# Altium project F2837x_180controlCARD_R1_3_SCH_PADS.PrjPcb (part 1 of 2)
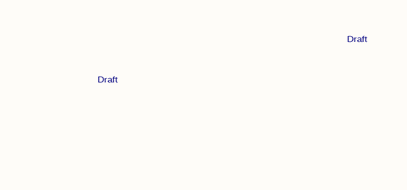
[diagram p0: TITLE.SchDoc, top right]
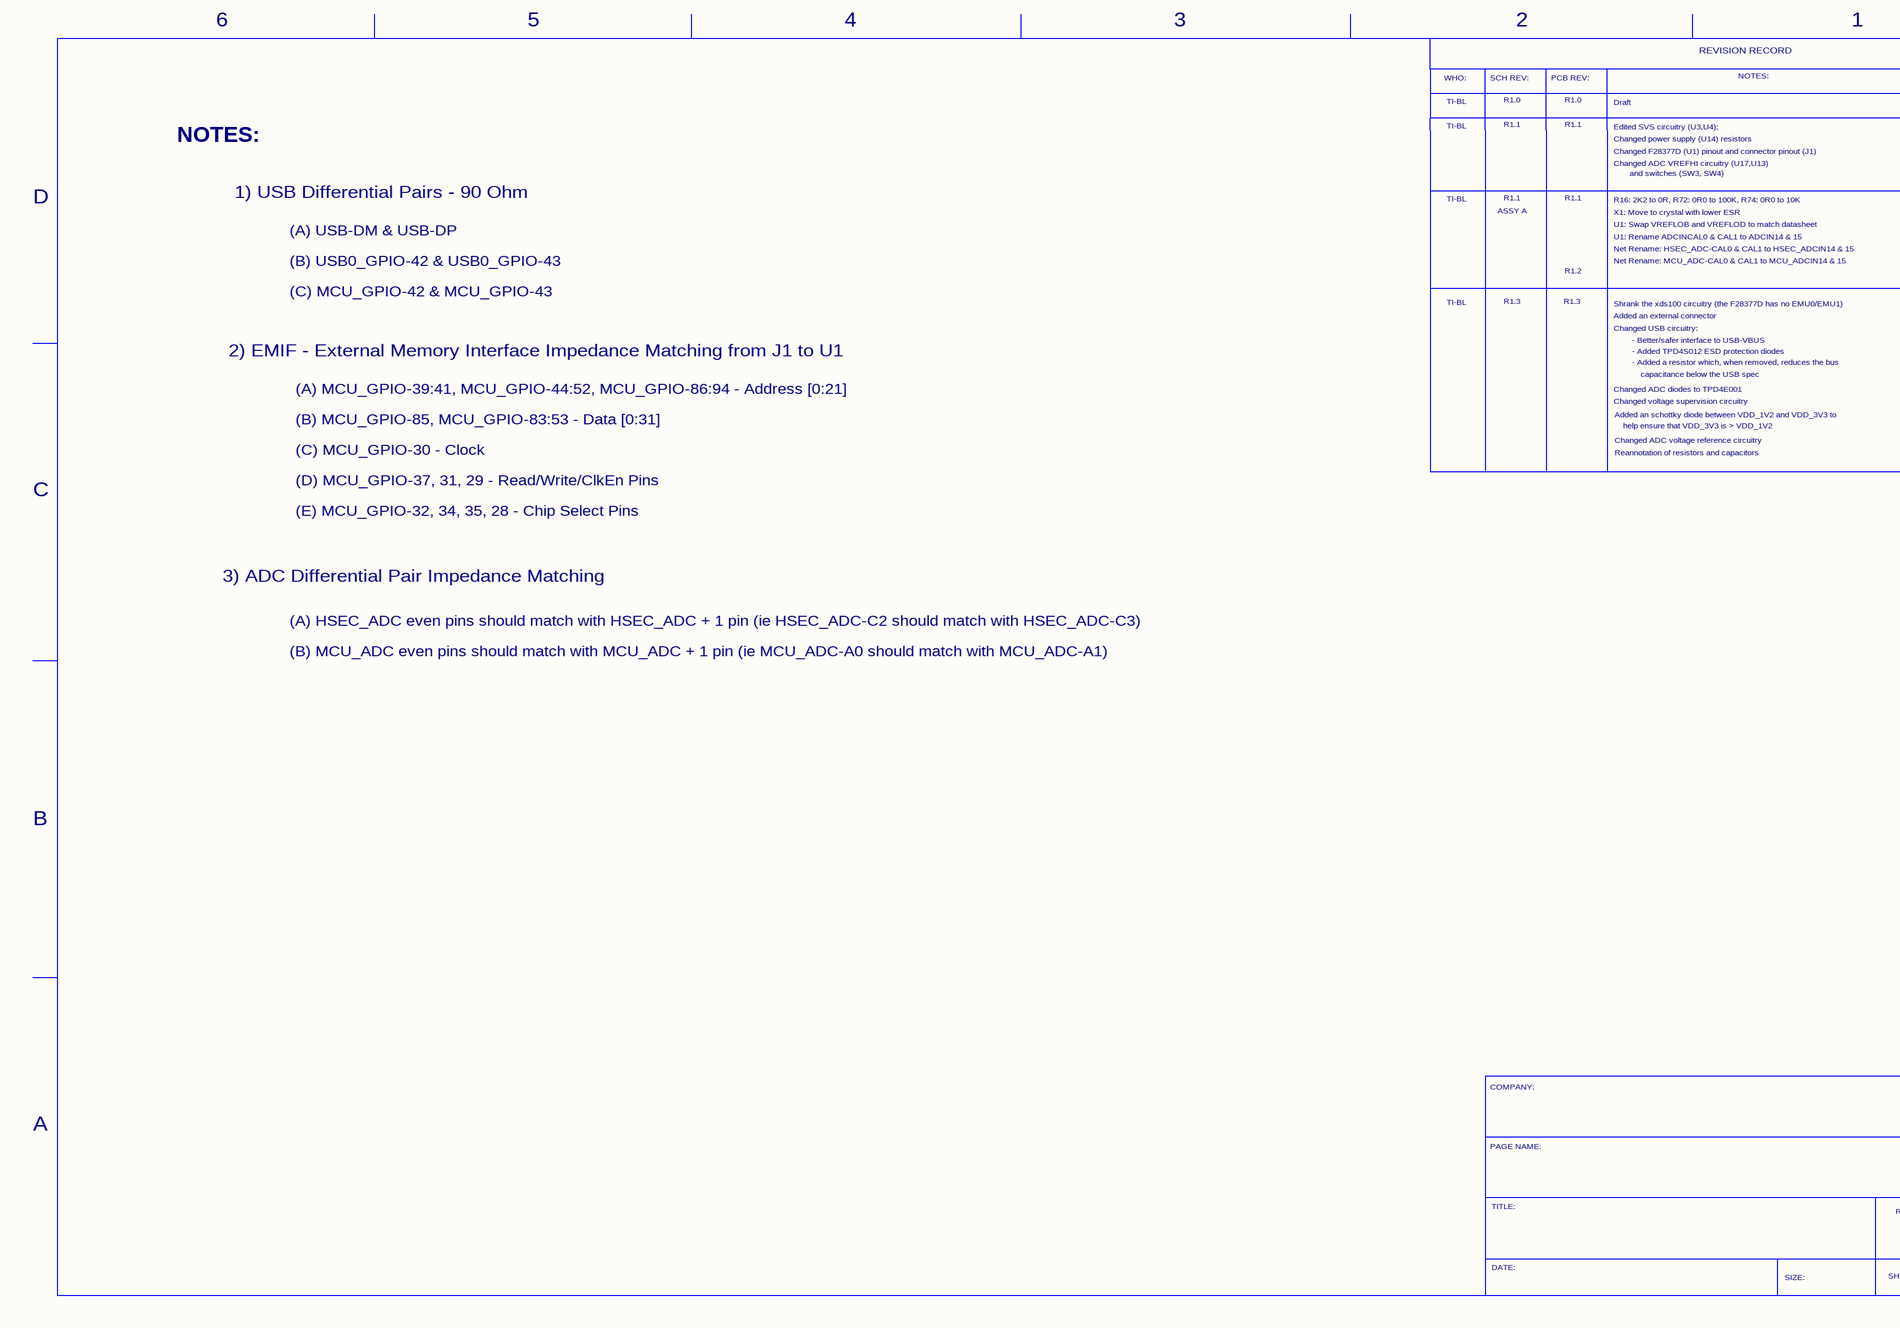
[diagram p1: TITLE.SchDoc, bottom left]
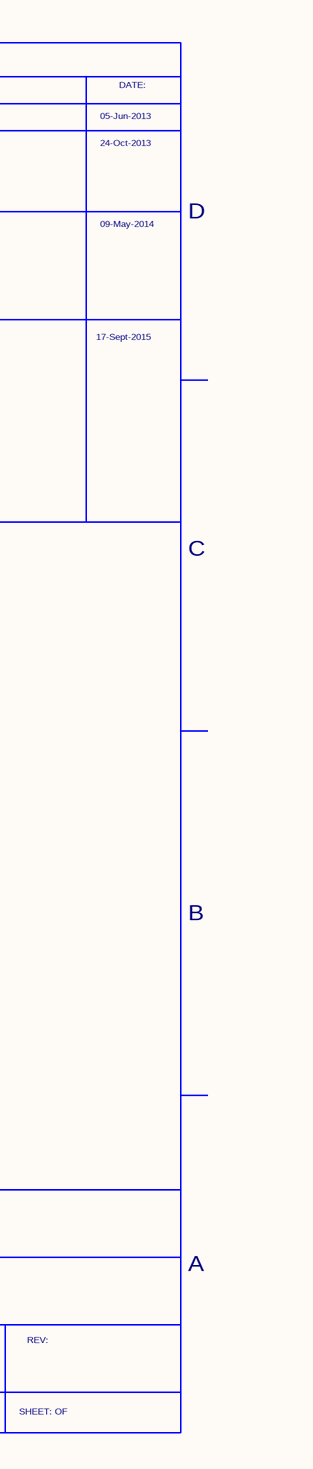
[diagram p2: TITLE.SchDoc, bottom right]
8 sheets, 292 parts. Net scope: flat (ports and power ports of the same name join across sheets).
Board file: {TEX137}_F2837x_controlCARD_R1.3_PCB_PADS.PcbDoc
Sheets:
  TITLE.SchDoc
  GPIO,CONNECTOR.SchDoc
  ADC.SchDoc
  POWER.SchDoc
  USB.SchDoc
  SUPPORT.SchDoc
  XDS100V2_EMULATOR.SchDoc
  EMULATOR_INTERFACE.SchDoc

## Sheet TITLE.SchDoc: F2837x controlCARD
size 431 x 279 mm; Organization: Texas Instruments; Revision: 1.3

### Notes on the sheet
- Draft
- 6
- 5
- 4
- 3
- 2
- REVISION RECORD
- 1
- WHO:
- TI-BL
- SCH REV:
- R1.1
- R1.0
- PCB REV:
- Edited SVS circuitry (U3,U4);
- NOTES:
- 24-Oct-2013
- 05-Jun-2013
- DATE:
- Changed power supply (U14) resistors
- Changed F28377D (U1) pinout and connector pinout (J1)
- Changed ADC VREFHI circuitry (U17,U13)
- and switches (SW3, SW4)
- D
- 1) USB Differential Pairs - 90 Ohm
- (A) USB-DM & USB-DP
- ASSY A
- R16: 2K2 to 0R, R72: 0R0 to 100K, R74: 0R0 to 10K
- Net Rename: HSEC_ADC-CAL0 & CAL1 to HSEC_ADCIN14 & 15
- U1: Swap VREFLOB and VREFLOD to match datasheet
- U1: Rename ADCINCAL0 & CAL1 to ADCIN14 & 15
- X1: Move to crystal with lower ESR
- 09-May-2014
- (B) USB0_GPIO-42 & USB0_GPIO-43
- (C) MCU_GPIO-42 & MCU_GPIO-43
- R1.3
- R1.2
- Net Rename: MCU_ADC-CAL0 & CAL1 to MCU_ADCIN14 & 15
- Shrank the xds100 circuitry (the F28377D has no EMU0/EMU1)
- Added an external connector
- 17-Sept-2015
- 2) EMIF - External Memory Interface Impedance Matching from J1 to U1
- Changed USB circuitry:
- - Better/safer interface to USB-VBUS
- - Added TPD4S012 ESD protection diodes
- - Added a resistor which, when removed, reduces the bus
- capacitance below the USB spec
- (A) MCU_GPIO-39:41, MCU_GPIO-44:52, MCU_GPIO-86:94 - Address [0:21]
- (B) MCU_GPIO-85, MCU_GPIO-83:53 - Data [0:31]
- Changed voltage supervision circuitry
- Changed ADC diodes to TPD4E001
- Added an schottky diode between VDD_1V2 and VDD_3V3 to
- Changed ADC voltage reference circuitry
- help ensure that VDD_3V3 is > VDD_1V2
- C
- (C) MCU_GPIO-30 - Clock
- (D) MCU_GPIO-37, 31, 29 - Read/Write/ClkEn Pins
- Reannotation of resistors and capacitors
- (E) MCU_GPIO-32, 34, 35, 28 - Chip Select Pins
- 3) ADC Differential Pair Impedance Matching
- (A) HSEC_ADC even pins should match with HSEC_ADC + 1 pin (ie HSEC_ADC-C2 should match with HSEC_ADC-C3)
- (B) MCU_ADC even pins should match with MCU_ADC + 1 pin (ie MCU_ADC-A0 should match with MCU_ADC-A1)
- B
- COMPANY:
- A
- PAGE NAME:
- TITLE:
- REV:
- SIZE:
- SHEET: OF

## Sheet GPIO,CONNECTOR.SchDoc: F2837x controlCARD
size 431 x 279 mm; Organization: Texas Instruments; Revision: 1.3
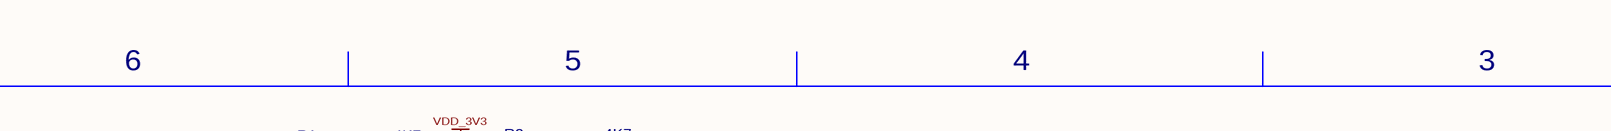
[diagram p3: GPIO,CONNECTOR.SchDoc, top left]
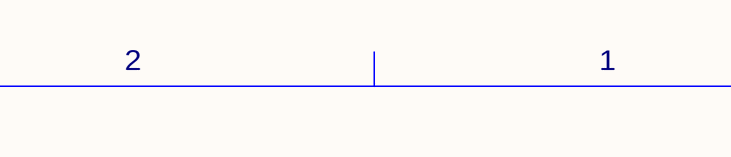
[diagram p4: GPIO,CONNECTOR.SchDoc, top right]
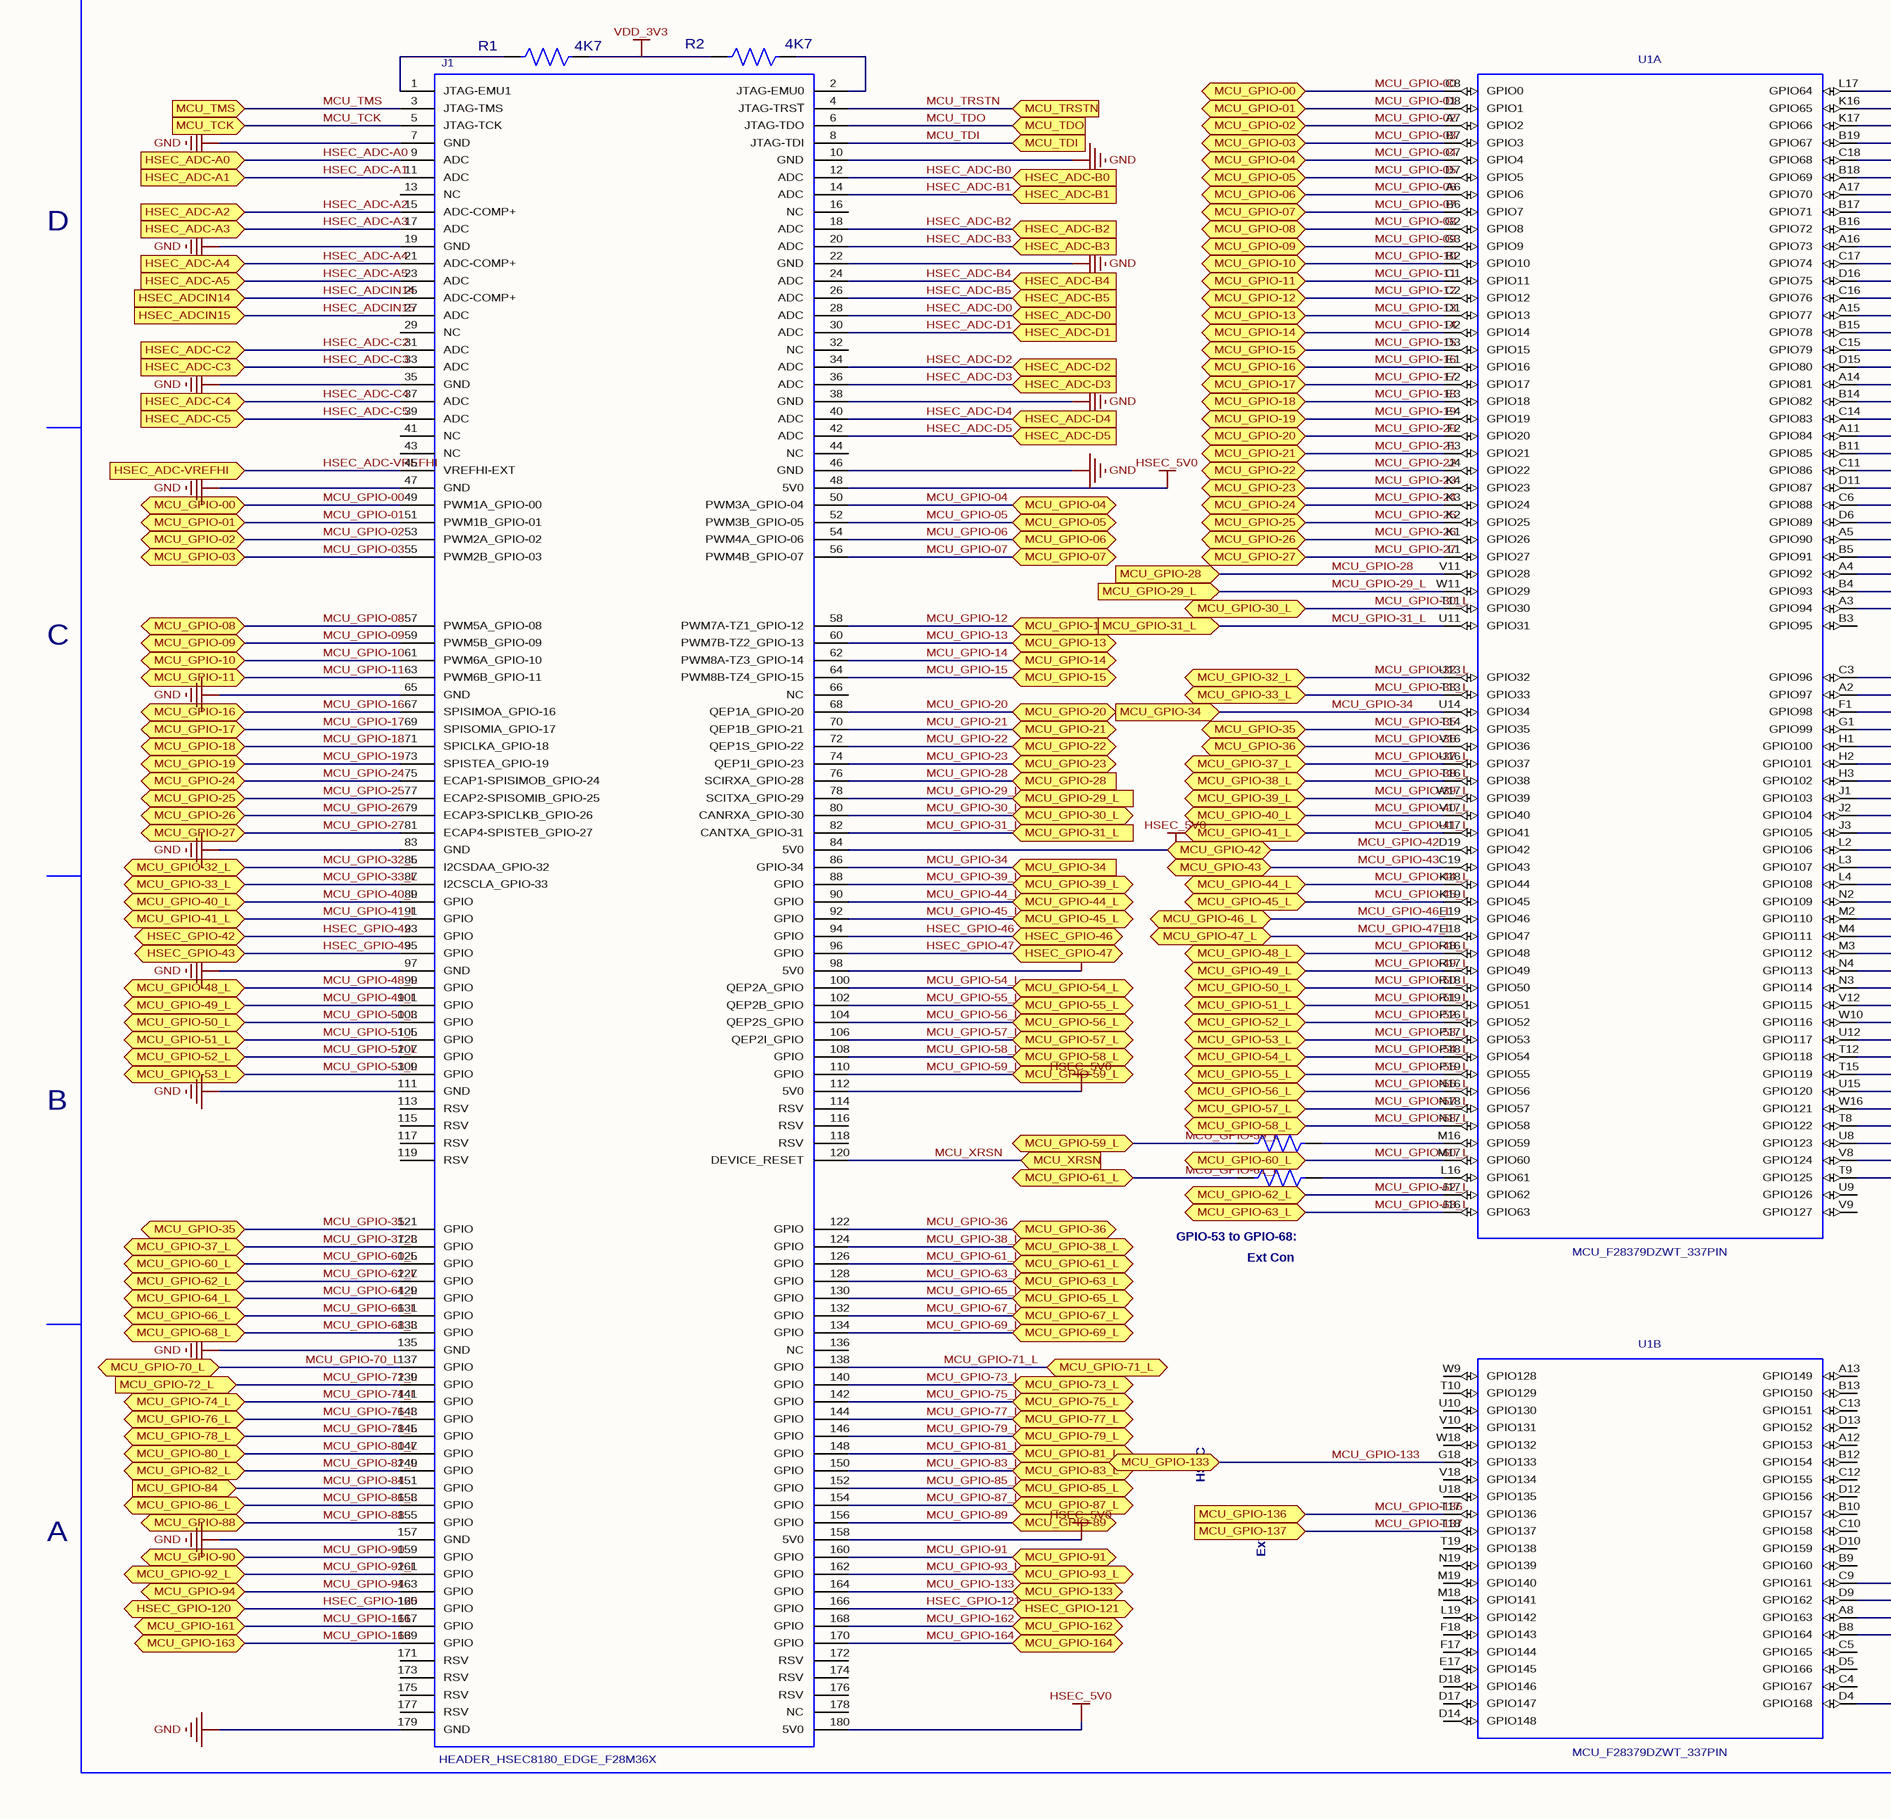
[diagram p5: GPIO,CONNECTOR.SchDoc, bottom left]
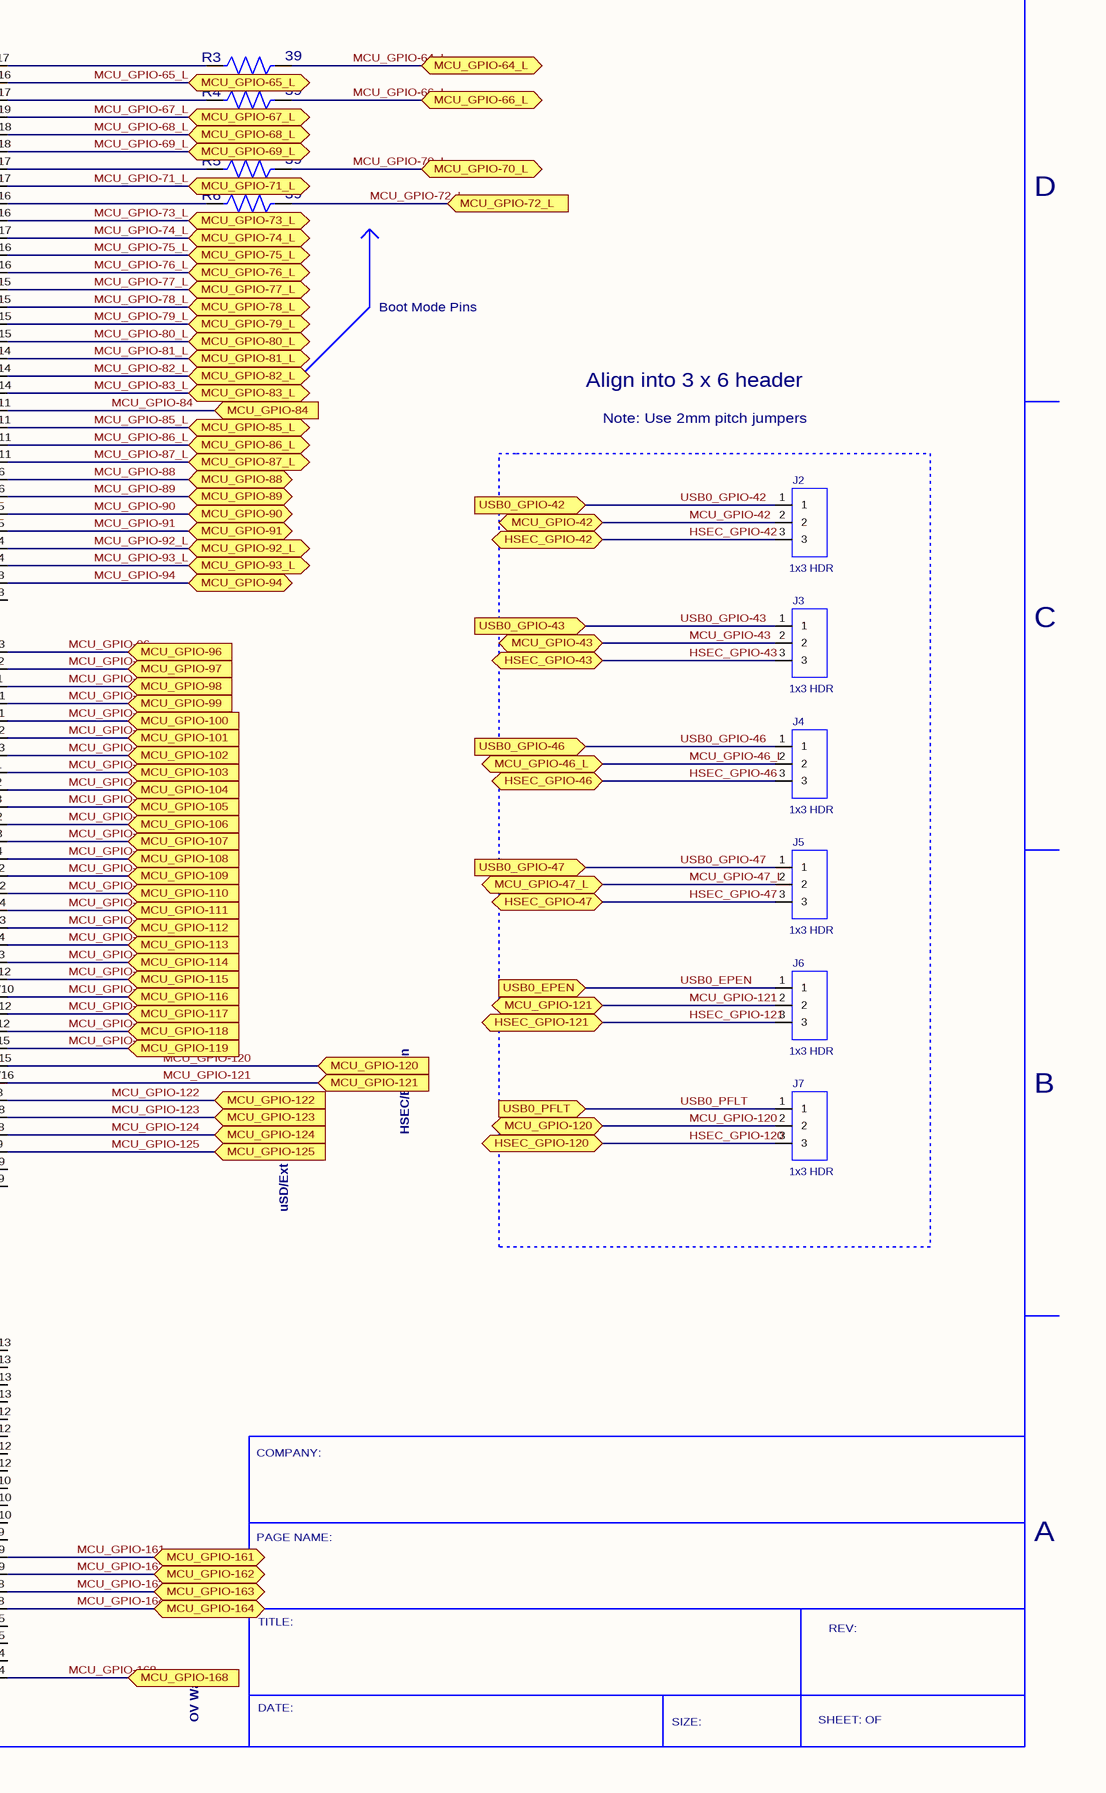
[diagram p6: GPIO,CONNECTOR.SchDoc, bottom right]

### Parts
J1  HEADER_HSEC8180_EDGE_F28M36X  [HEADER_HSEC8_180_EDGE]
J2  value 1x3 HDR  [HDR1X3_2MM]  (hidden comment: HEADER_1X3_079)
J3  value 1x3 HDR  [HDR1X3_2MM]  (hidden comment: HEADER_1X3_079)
J4  value 1x3 HDR  [HDR1X3_2MM]  (hidden comment: HEADER_1X3_079)
J5  value 1x3 HDR  [HDR1X3_2MM]  (hidden comment: HEADER_1X3_079)
J6  value 1x3 HDR  [HDR1X3_2MM]  (hidden comment: HEADER_1X3_079)
J7  value 1x3 HDR  [HDR1X3_2MM]  (hidden comment: HEADER_1X3_079)
R1  value 4K7  [R0402]  (hidden comment: R0402_1%)
R2  value 4K7  [R0402]  (hidden comment: R0402_1%)
R3  value 39  [R0402]  (hidden comment: R0402_5%)
R4  value 39  [R0402]  (hidden comment: R0402_5%)
R5  value 39  [R0402]  (hidden comment: R0402_5%)
R6  value 39  [R0402]  (hidden comment: R0402_5%)
R7  value 39  [R0402]  (hidden comment: R0402_5%)
R8  value 39  [R0402]  (hidden comment: R0402_5%)
U1  MCU_F28379DZWT_337PIN  [TI_ZWT_337BGA]  (parts A,B of 5)

### Ports
HSEC_ADC-A0, HSEC_ADC-A1, HSEC_ADC-A2, HSEC_ADC-A3, HSEC_ADC-A4, HSEC_ADC-A5, HSEC_ADC-B0, HSEC_ADC-B1, HSEC_ADC-B2, HSEC_ADC-B3, HSEC_ADC-B4, HSEC_ADC-B5, HSEC_ADC-C2, HSEC_ADC-C3, HSEC_ADC-C4, HSEC_ADC-C5, HSEC_ADC-D0, HSEC_ADC-D1, HSEC_ADC-D2, HSEC_ADC-D3, HSEC_ADC-D4, HSEC_ADC-D5, HSEC_ADC-VREFHI, HSEC_ADCIN14, HSEC_ADCIN15, HSEC_GPIO-42 (bidir), HSEC_GPIO-43 (bidir), HSEC_GPIO-46 (bidir), HSEC_GPIO-47 (bidir), HSEC_GPIO-120 (bidir), HSEC_GPIO-121 (bidir), MCU_GPIO-00 (bidir), MCU_GPIO-01 (bidir), MCU_GPIO-02 (bidir), MCU_GPIO-03 (bidir), MCU_GPIO-04 (bidir), MCU_GPIO-05 (bidir), MCU_GPIO-06 (bidir), MCU_GPIO-07 (bidir), MCU_GPIO-08 (bidir), MCU_GPIO-09 (bidir), MCU_GPIO-10 (bidir), MCU_GPIO-11 (bidir), MCU_GPIO-12 (bidir), MCU_GPIO-13 (bidir), MCU_GPIO-14 (bidir), MCU_GPIO-15 (bidir), MCU_GPIO-16 (bidir), MCU_GPIO-17 (bidir), MCU_GPIO-18 (bidir), MCU_GPIO-19 (bidir), MCU_GPIO-20 (bidir), MCU_GPIO-21 (bidir), MCU_GPIO-22 (bidir), MCU_GPIO-23 (bidir), MCU_GPIO-24 (bidir), MCU_GPIO-25 (bidir), MCU_GPIO-26 (bidir), MCU_GPIO-27 (bidir), MCU_GPIO-28, MCU_GPIO-29_L, MCU_GPIO-30_L (bidir), MCU_GPIO-31_L, MCU_GPIO-32_L (bidir), MCU_GPIO-33_L (bidir), MCU_GPIO-34, MCU_GPIO-35 (bidir), MCU_GPIO-36 (bidir), MCU_GPIO-37_L (bidir), MCU_GPIO-38_L (bidir), MCU_GPIO-39_L (bidir), MCU_GPIO-40_L (bidir), MCU_GPIO-41_L (bidir), MCU_GPIO-42 (bidir), MCU_GPIO-43 (bidir), MCU_GPIO-44_L (bidir), MCU_GPIO-45_L (bidir), MCU_GPIO-46_L (bidir), MCU_GPIO-47_L (bidir), MCU_GPIO-48_L (bidir), MCU_GPIO-49_L (bidir), MCU_GPIO-50_L (bidir), MCU_GPIO-51_L (bidir), MCU_GPIO-52_L (bidir), MCU_GPIO-53_L (bidir), MCU_GPIO-54_L (bidir), MCU_GPIO-55_L (bidir), MCU_GPIO-56_L (bidir), MCU_GPIO-57_L (bidir), MCU_GPIO-58_L (bidir), MCU_GPIO-59_L (bidir), MCU_GPIO-60_L (bidir), MCU_GPIO-61_L (bidir), MCU_GPIO-62_L (bidir), MCU_GPIO-63_L (bidir), MCU_GPIO-64_L (bidir), MCU_GPIO-65_L (bidir), MCU_GPIO-66_L (bidir), MCU_GPIO-67_L (bidir), MCU_GPIO-68_L (bidir), MCU_GPIO-69_L (bidir), MCU_GPIO-70_L (bidir), MCU_GPIO-71_L (bidir), MCU_GPIO-72_L, MCU_GPIO-73_L (bidir), MCU_GPIO-74_L (bidir), MCU_GPIO-75_L (bidir), MCU_GPIO-76_L (bidir), MCU_GPIO-77_L (bidir), MCU_GPIO-78_L (bidir), MCU_GPIO-79_L (bidir), MCU_GPIO-80_L (bidir), MCU_GPIO-81_L (bidir), MCU_GPIO-82_L (bidir), MCU_GPIO-83_L (bidir), MCU_GPIO-84, MCU_GPIO-85_L (bidir), MCU_GPIO-86_L (bidir), MCU_GPIO-87_L (bidir), MCU_GPIO-88 (bidir), MCU_GPIO-89 (bidir), MCU_GPIO-90 (bidir), MCU_GPIO-91 (bidir), MCU_GPIO-92_L (bidir), MCU_GPIO-93_L (bidir), MCU_GPIO-94 (bidir), MCU_GPIO-96, MCU_GPIO-97, MCU_GPIO-98, MCU_GPIO-99, MCU_GPIO-100, MCU_GPIO-101, MCU_GPIO-102, MCU_GPIO-103, MCU_GPIO-104, MCU_GPIO-105, MCU_GPIO-106, MCU_GPIO-107, MCU_GPIO-108, MCU_GPIO-109, MCU_GPIO-110, MCU_GPIO-111, MCU_GPIO-112, MCU_GPIO-113, MCU_GPIO-114, MCU_GPIO-115, MCU_GPIO-116, MCU_GPIO-117, MCU_GPIO-118, MCU_GPIO-119, MCU_GPIO-120, MCU_GPIO-120 (bidir), MCU_GPIO-121, MCU_GPIO-121 (bidir), MCU_GPIO-122, MCU_GPIO-123, MCU_GPIO-124, MCU_GPIO-125, MCU_GPIO-133 (bidir), MCU_GPIO-136, MCU_GPIO-137, MCU_GPIO-161 (bidir), MCU_GPIO-162 (bidir), MCU_GPIO-163 (bidir), MCU_GPIO-164 (bidir), MCU_GPIO-168, MCU_TCK, MCU_TDI, MCU_TDO, MCU_TMS, MCU_TRSTN, MCU_XRSN, USB0_EPEN, USB0_GPIO-42, USB0_GPIO-43, USB0_GPIO-46, USB0_GPIO-47, USB0_PFLT

### Nets
GND: J1.7(GND) J1.10(GND) J1.19(GND) J1.22(GND) J1.35(GND) J1.38(GND) J1.46(GND) J1.47(GND) J1.65(GND) J1.83(GND) J1.97(GND) J1.111(GND) J1.135(GND) J1.157(GND) J1.179(GND)
MCU_GPIO-42: J1.48(5V0) J1.84(5V0) J1.98(5V0) J1.112(5V0) J1.158(5V0) J1.180(5V0) J2.2 U1.D19(GPIO42) ; port MCU_GPIO-42  [also labelled HSEC_5V0]
VDD_3V3: R1.1 R2.2
HSEC_ADC-A0: J1.9(ADC) ; port HSEC_ADC-A0
HSEC_ADC-A1: J1.11(ADC) ; port HSEC_ADC-A1
HSEC_ADC-A2: J1.15(ADC-COMP+) ; port HSEC_ADC-A2
HSEC_ADC-A3: J1.17(ADC) ; port HSEC_ADC-A3
HSEC_ADC-A4: J1.21(ADC-COMP+) ; port HSEC_ADC-A4
HSEC_ADC-A5: J1.23(ADC) ; port HSEC_ADC-A5
HSEC_ADC-B0: J1.12(ADC) ; port HSEC_ADC-B0
HSEC_ADC-B1: J1.14(ADC) ; port HSEC_ADC-B1
HSEC_ADC-B2: J1.18(ADC) ; port HSEC_ADC-B2
HSEC_ADC-B3: J1.20(ADC) ; port HSEC_ADC-B3
HSEC_ADC-B4: J1.24(ADC) ; port HSEC_ADC-B4
HSEC_ADC-B5: J1.26(ADC) ; port HSEC_ADC-B5
HSEC_ADC-C2: J1.31(ADC) ; port HSEC_ADC-C2
HSEC_ADC-C3: J1.33(ADC) ; port HSEC_ADC-C3
HSEC_ADC-C4: J1.37(ADC) ; port HSEC_ADC-C4
HSEC_ADC-C5: J1.39(ADC) ; port HSEC_ADC-C5
HSEC_ADC-D0: J1.28(ADC) ; port HSEC_ADC-D0
HSEC_ADC-D1: J1.30(ADC) ; port HSEC_ADC-D1
HSEC_ADC-D2: J1.34(ADC) ; port HSEC_ADC-D2
HSEC_ADC-D3: J1.36(ADC) ; port HSEC_ADC-D3
HSEC_ADC-D4: J1.40(ADC) ; port HSEC_ADC-D4
HSEC_ADC-D5: J1.42(ADC) ; port HSEC_ADC-D5
HSEC_ADC-VREFHI: J1.45(VREFHI-EXT) ; port HSEC_ADC-VREFHI
HSEC_ADCIN14: J1.25(ADC-COMP+) ; port HSEC_ADCIN14
HSEC_ADCIN15: J1.27(ADC) ; port HSEC_ADCIN15
HSEC_GPIO-42: J1.93(GPIO) J2.3 ; port HSEC_GPIO-42
HSEC_GPIO-43: J1.95(GPIO) J3.3 ; port HSEC_GPIO-43
HSEC_GPIO-46: J1.94(GPIO) J4.3 ; port HSEC_GPIO-46
HSEC_GPIO-47: J1.96(GPIO) J5.3 ; port HSEC_GPIO-47
HSEC_GPIO-120: J1.165(GPIO) J7.3 ; port HSEC_GPIO-120
HSEC_GPIO-121: J1.166(GPIO) J6.3 ; port HSEC_GPIO-121
MCU_GPIO-00: J1.49(PWM1A_GPIO-00) U1.C8(GPIO0) ; port MCU_GPIO-00
MCU_GPIO-01: J1.51(PWM1B_GPIO-01) U1.D8(GPIO1) ; port MCU_GPIO-01
MCU_GPIO-02: J1.53(PWM2A_GPIO-02) U1.A7(GPIO2) ; port MCU_GPIO-02
MCU_GPIO-03: J1.55(PWM2B_GPIO-03) U1.B7(GPIO3) ; port MCU_GPIO-03
MCU_GPIO-04: J1.50(PWM3A_GPIO-04) U1.C7(GPIO4) ; port MCU_GPIO-04
MCU_GPIO-05: J1.52(PWM3B_GPIO-05) U1.D7(GPIO5) ; port MCU_GPIO-05
MCU_GPIO-06: J1.54(PWM4A_GPIO-06) U1.A6(GPIO6) ; port MCU_GPIO-06
MCU_GPIO-07: J1.56(PWM4B_GPIO-07) U1.B6(GPIO7) ; port MCU_GPIO-07
MCU_GPIO-08: J1.57(PWM5A_GPIO-08) U1.G2(GPIO8) ; port MCU_GPIO-08
MCU_GPIO-09: J1.59(PWM5B_GPIO-09) U1.G3(GPIO9) ; port MCU_GPIO-09
MCU_GPIO-10: J1.61(PWM6A_GPIO-10) U1.B2(GPIO10) ; port MCU_GPIO-10
MCU_GPIO-11: J1.63(PWM6B_GPIO-11) U1.C1(GPIO11) ; port MCU_GPIO-11
MCU_GPIO-12: J1.58(PWM7A-TZ1_GPIO-12) U1.C2(GPIO12) ; port MCU_GPIO-12
MCU_GPIO-13: J1.60(PWM7B-TZ2_GPIO-13) U1.D1(GPIO13) ; port MCU_GPIO-13
MCU_GPIO-14: J1.62(PWM8A-TZ3_GPIO-14) U1.D2(GPIO14) ; port MCU_GPIO-14
MCU_GPIO-15: J1.64(PWM8B-TZ4_GPIO-15) U1.D3(GPIO15) ; port MCU_GPIO-15
MCU_GPIO-16: J1.67(SPISIMOA_GPIO-16) U1.E1(GPIO16) ; port MCU_GPIO-16
MCU_GPIO-17: J1.69(SPISOMIA_GPIO-17) U1.E2(GPIO17) ; port MCU_GPIO-17
MCU_GPIO-18: J1.71(SPICLKA_GPIO-18) U1.E3(GPIO18) ; port MCU_GPIO-18
MCU_GPIO-19: J1.73(SPISTEA_GPIO-19) U1.E4(GPIO19) ; port MCU_GPIO-19
MCU_GPIO-20: J1.68(QEP1A_GPIO-20) J1.86(GPIO-34) U1.F2(GPIO20) U1.U14(GPIO34) ; port MCU_GPIO-20, port MCU_GPIO-34  [also labelled MCU_GPIO-34]
MCU_GPIO-21: J1.70(QEP1B_GPIO-21) U1.F3(GPIO21) ; port MCU_GPIO-21
MCU_GPIO-22: J1.72(QEP1S_GPIO-22) U1.J4(GPIO22) ; port MCU_GPIO-22
MCU_GPIO-23: J1.74(QEP1I_GPIO-23) U1.K4(GPIO23) ; port MCU_GPIO-23
MCU_GPIO-24: J1.75(ECAP1-SPISIMOB_GPIO-24) U1.K3(GPIO24) ; port MCU_GPIO-24
MCU_GPIO-25: J1.77(ECAP2-SPISOMIB_GPIO-25) U1.K2(GPIO25) ; port MCU_GPIO-25
MCU_GPIO-26: J1.79(ECAP3-SPICLKB_GPIO-26) U1.K1(GPIO26) ; port MCU_GPIO-26
MCU_GPIO-27: J1.81(ECAP4-SPISTEB_GPIO-27) U1.L1(GPIO27) ; port MCU_GPIO-27
MCU_GPIO-28: J1.76(SCIRXA_GPIO-28) U1.V11(GPIO28) ; port MCU_GPIO-28
MCU_GPIO-29_L: J1.78(SCITXA_GPIO-29) U1.W11(GPIO29) ; port MCU_GPIO-29_L
MCU_GPIO-30_L: J1.80(CANRXA_GPIO-30) U1.T11(GPIO30) ; port MCU_GPIO-30_L
MCU_GPIO-31_L: J1.82(CANTXA_GPIO-31) U1.U11(GPIO31) ; port MCU_GPIO-31_L
MCU_GPIO-32_L: J1.85(I2CSDAA_GPIO-32) U1.U13(GPIO32) ; port MCU_GPIO-32_L
MCU_GPIO-33_L: J1.87(I2CSCLA_GPIO-33) U1.T13(GPIO33) ; port MCU_GPIO-33_L
MCU_GPIO-35: J1.121(GPIO) U1.T14(GPIO35) ; port MCU_GPIO-35
MCU_GPIO-36: J1.122(GPIO) U1.V16(GPIO36) ; port MCU_GPIO-36
MCU_GPIO-37_L: J1.123(GPIO) U1.U16(GPIO37) ; port MCU_GPIO-37_L
MCU_GPIO-38_L: J1.124(GPIO) U1.T16(GPIO38) ; port MCU_GPIO-38_L
MCU_GPIO-39_L: J1.88(GPIO) U1.W17(GPIO39) ; port MCU_GPIO-39_L
MCU_GPIO-40_L: J1.89(GPIO) U1.V17(GPIO40) ; port MCU_GPIO-40_L
MCU_GPIO-41_L: J1.91(GPIO) U1.U17(GPIO41) ; port MCU_GPIO-41_L
MCU_GPIO-43: J3.2 U1.C19(GPIO43) ; port MCU_GPIO-43
MCU_GPIO-44_L: J1.90(GPIO) U1.K18(GPIO44) ; port MCU_GPIO-44_L
MCU_GPIO-45_L: J1.92(GPIO) U1.K19(GPIO45) ; port MCU_GPIO-45_L
MCU_GPIO-46_L: J4.2 U1.E19(GPIO46) ; port MCU_GPIO-46_L
MCU_GPIO-47_L: J5.2 U1.E18(GPIO47) ; port MCU_GPIO-47_L
MCU_GPIO-48_L: J1.99(GPIO) U1.R16(GPIO48) ; port MCU_GPIO-48_L
MCU_GPIO-49_L: J1.101(GPIO) U1.R17(GPIO49) ; port MCU_GPIO-49_L
MCU_GPIO-50_L: J1.103(GPIO) U1.R18(GPIO50) ; port MCU_GPIO-50_L
MCU_GPIO-51_L: J1.105(GPIO) U1.R19(GPIO51) ; port MCU_GPIO-51_L
MCU_GPIO-52_L: J1.107(GPIO) U1.P16(GPIO52) ; port MCU_GPIO-52_L
MCU_GPIO-53_L: J1.109(GPIO) U1.P17(GPIO53) ; port MCU_GPIO-53_L
MCU_GPIO-54_L: J1.100(QEP2A_GPIO) U1.P18(GPIO54) ; port MCU_GPIO-54_L
MCU_GPIO-55_L: J1.102(QEP2B_GPIO) U1.P19(GPIO55) ; port MCU_GPIO-55_L
MCU_GPIO-56_L: J1.104(QEP2S_GPIO) U1.N16(GPIO56) ; port MCU_GPIO-56_L
MCU_GPIO-57_L: J1.106(QEP2I_GPIO) U1.N18(GPIO57) ; port MCU_GPIO-57_L
MCU_GPIO-58_L: J1.108(GPIO) U1.N17(GPIO58) ; port MCU_GPIO-58_L
MCU_GPIO-59_L: J1.110(GPIO) R7.1 ; port MCU_GPIO-59_L
MCU_GPIO-60_L: J1.125(GPIO) U1.M17(GPIO60) ; port MCU_GPIO-60_L
MCU_GPIO-61_L: J1.126(GPIO) R8.1 ; port MCU_GPIO-61_L
MCU_GPIO-62_L: J1.127(GPIO) U1.J17(GPIO62) ; port MCU_GPIO-62_L
MCU_GPIO-63_L: J1.128(GPIO) U1.J16(GPIO63) ; port MCU_GPIO-63_L
MCU_GPIO-64_L: J1.129(GPIO) R3.2 ; port MCU_GPIO-64_L
MCU_GPIO-65_L: J1.130(GPIO) U1.K16(GPIO65) ; port MCU_GPIO-65_L
MCU_GPIO-66_L: J1.131(GPIO) R4.2 ; port MCU_GPIO-66_L
MCU_GPIO-67_L: J1.132(GPIO) U1.B19(GPIO67) ; port MCU_GPIO-67_L
MCU_GPIO-68_L: J1.133(GPIO) U1.C18(GPIO68) ; port MCU_GPIO-68_L
MCU_GPIO-69_L: J1.134(GPIO) U1.B18(GPIO69) ; port MCU_GPIO-69_L
MCU_GPIO-70_L: J1.137(GPIO) R5.2 ; port MCU_GPIO-70_L
MCU_GPIO-71_L: J1.138(GPIO) U1.B17(GPIO71) ; port MCU_GPIO-71_L
MCU_GPIO-72_L: J1.139(GPIO) R6.2 ; port MCU_GPIO-72_L
MCU_GPIO-73_L: J1.140(GPIO) U1.A16(GPIO73) ; port MCU_GPIO-73_L
MCU_GPIO-74_L: J1.141(GPIO) U1.C17(GPIO74) ; port MCU_GPIO-74_L
MCU_GPIO-75_L: J1.142(GPIO) U1.D16(GPIO75) ; port MCU_GPIO-75_L
MCU_GPIO-76_L: J1.143(GPIO) U1.C16(GPIO76) ; port MCU_GPIO-76_L
MCU_GPIO-77_L: J1.144(GPIO) U1.A15(GPIO77) ; port MCU_GPIO-77_L
MCU_GPIO-78_L: J1.145(GPIO) U1.B15(GPIO78) ; port MCU_GPIO-78_L
MCU_GPIO-79_L: J1.146(GPIO) U1.C15(GPIO79) ; port MCU_GPIO-79_L
MCU_GPIO-80_L: J1.147(GPIO) U1.D15(GPIO80) ; port MCU_GPIO-80_L
MCU_GPIO-81_L: J1.148(GPIO) U1.A14(GPIO81) ; port MCU_GPIO-81_L
MCU_GPIO-82_L: J1.149(GPIO) U1.B14(GPIO82) ; port MCU_GPIO-82_L
MCU_GPIO-83_L: J1.150(GPIO) U1.C14(GPIO83) ; port MCU_GPIO-83_L
MCU_GPIO-84: J1.151(GPIO) U1.A11(GPIO84) ; port MCU_GPIO-84
MCU_GPIO-85_L: J1.152(GPIO) U1.B11(GPIO85) ; port MCU_GPIO-85_L
MCU_GPIO-86_L: J1.153(GPIO) U1.C11(GPIO86) ; port MCU_GPIO-86_L
MCU_GPIO-87_L: J1.154(GPIO) U1.D11(GPIO87) ; port MCU_GPIO-87_L
MCU_GPIO-88: J1.155(GPIO) U1.C6(GPIO88) ; port MCU_GPIO-88
MCU_GPIO-89: J1.156(GPIO) U1.D6(GPIO89) ; port MCU_GPIO-89
MCU_GPIO-90: J1.159(GPIO) U1.A5(GPIO90) ; port MCU_GPIO-90
MCU_GPIO-91: J1.160(GPIO) U1.B5(GPIO91) ; port MCU_GPIO-91
MCU_GPIO-92_L: J1.161(GPIO) U1.A4(GPIO92) ; port MCU_GPIO-92_L
MCU_GPIO-93_L: J1.162(GPIO) U1.B4(GPIO93) ; port MCU_GPIO-93_L
MCU_GPIO-94: J1.163(GPIO) U1.A3(GPIO94) ; port MCU_GPIO-94
MCU_GPIO-96: U1.C3(GPIO96) ; port MCU_GPIO-96
MCU_GPIO-97: U1.A2(GPIO97) ; port MCU_GPIO-97
MCU_GPIO-98: U1.F1(GPIO98) ; port MCU_GPIO-98
MCU_GPIO-99: U1.G1(GPIO99) ; port MCU_GPIO-99
MCU_GPIO-100: U1.H1(GPIO100) ; port MCU_GPIO-100
MCU_GPIO-101: U1.H2(GPIO101) ; port MCU_GPIO-101
MCU_GPIO-102: U1.H3(GPIO102) ; port MCU_GPIO-102
MCU_GPIO-103: U1.J1(GPIO103) ; port MCU_GPIO-103
MCU_GPIO-104: U1.J2(GPIO104) ; port MCU_GPIO-104
MCU_GPIO-105: U1.J3(GPIO105) ; port MCU_GPIO-105
MCU_GPIO-106: U1.L2(GPIO106) ; port MCU_GPIO-106
MCU_GPIO-107: U1.L3(GPIO107) ; port MCU_GPIO-107
MCU_GPIO-108: U1.L4(GPIO108) ; port MCU_GPIO-108
MCU_GPIO-109: U1.N2(GPIO109) ; port MCU_GPIO-109
MCU_GPIO-110: U1.M2(GPIO110) ; port MCU_GPIO-110
MCU_GPIO-111: U1.M4(GPIO111) ; port MCU_GPIO-111
MCU_GPIO-112: U1.M3(GPIO112) ; port MCU_GPIO-112
MCU_GPIO-113: U1.N4(GPIO113) ; port MCU_GPIO-113
MCU_GPIO-114: U1.N3(GPIO114) ; port MCU_GPIO-114
MCU_GPIO-115: U1.V12(GPIO115) ; port MCU_GPIO-115
MCU_GPIO-116: U1.W10(GPIO116) ; port MCU_GPIO-116
MCU_GPIO-117: U1.U12(GPIO117) ; port MCU_GPIO-117
MCU_GPIO-118: U1.T12(GPIO118) ; port MCU_GPIO-118
MCU_GPIO-119: U1.T15(GPIO119) ; port MCU_GPIO-119
MCU_GPIO-120: J7.2 U1.U15(GPIO120) ; port MCU_GPIO-120
MCU_GPIO-121: J6.2 U1.W16(GPIO121) ; port MCU_GPIO-121
MCU_GPIO-122: U1.T8(GPIO122) ; port MCU_GPIO-122
MCU_GPIO-123: U1.U8(GPIO123) ; port MCU_GPIO-123
MCU_GPIO-124: U1.V8(GPIO124) ; port MCU_GPIO-124
MCU_GPIO-125: U1.T9(GPIO125) ; port MCU_GPIO-125
MCU_GPIO-133: J1.164(GPIO) U1.G18(GPIO133) ; port MCU_GPIO-133
MCU_GPIO-136: U1.T17(GPIO136) ; port MCU_GPIO-136
MCU_GPIO-137: U1.T18(GPIO137) ; port MCU_GPIO-137
MCU_GPIO-161: J1.167(GPIO) U1.C9(GPIO161) ; port MCU_GPIO-161
MCU_GPIO-162: J1.168(GPIO) U1.D9(GPIO162) ; port MCU_GPIO-162
MCU_GPIO-163: J1.169(GPIO) U1.A8(GPIO163) ; port MCU_GPIO-163
MCU_GPIO-164: J1.170(GPIO) U1.B8(GPIO164) ; port MCU_GPIO-164
MCU_GPIO-168: U1.D4(GPIO168) ; port MCU_GPIO-168
MCU_TCK: J1.5(JTAG-TCK) ; port MCU_TCK
MCU_TDI: J1.8(JTAG-TDI) ; port MCU_TDI
MCU_TDO: J1.6(JTAG-TDO) ; port MCU_TDO
MCU_TMS: J1.3(JTAG-TMS) ; port MCU_TMS
MCU_TRSTN: J1.4(JTAG-TRS~{T}) ; port MCU_TRSTN
MCU_XRSN: J1.120(DEVICE_RESET) ; port MCU_XRSN
USB0_EPEN: J6.1 ; port USB0_EPEN
USB0_GPIO-42: J2.1 ; port USB0_GPIO-42
USB0_GPIO-43: J3.1 ; port USB0_GPIO-43
USB0_GPIO-46: J4.1 ; port USB0_GPIO-46
USB0_GPIO-47: J5.1 ; port USB0_GPIO-47
USB0_PFLT: J7.1 ; port USB0_PFLT
NetJ1_1: J1.1(JTAG-EMU1) R1.2
NetJ1_2: J1.2(JTAG-EMU0) R2.1
NetR3_1: R3.1 U1.L17(GPIO64)
NetR4_1: R4.1 U1.K17(GPIO66)
NetR5_1: R5.1 U1.A17(GPIO70)
NetR6_1: R6.1 U1.B16(GPIO72)
NetR7_2: R7.2 U1.M16(GPIO59)
NetR8_2: R8.2 U1.L16(GPIO61)

Not connected (* = marked no-connect by the designer): J1 13(NC) 16(NC) 29(NC) 32(NC) 41(NC) 43(NC) 44(NC) 66(NC) 113(RSV) 114(RSV) 115(RSV) 116(RSV) 117(RSV) 118(RSV) 119(RSV) 136(NC) 171(RSV) 172(RSV) 173(RSV) 174(RSV) 175(RSV) 176(RSV) 177(RSV) 178(NC); U1 A12(GPIO153) A13(GPIO149) B3(GPIO95) B9(GPIO160) B10(GPIO157) B12(GPIO154) B13(GPIO150) C4(GPIO167) C5(GPIO165) C10(GPIO158) C12(GPIO155) C13(GPIO151) D5(GPIO166) D10(GPIO159) D12(GPIO156) D13(GPIO152) D14(GPIO148) D17(GPIO147) D18(GPIO146) E17(GPIO145) F17(GPIO144) F18(GPIO143) L19(GPIO142) M18(GPIO141) M19(GPIO140) N19(GPIO139) T10(GPIO129) T19(GPIO138) U9(GPIO126) U10(GPIO130) U18(GPIO135) V9(GPIO127) V10(GPIO131) V18(GPIO134) W9(GPIO128) W18(GPIO132)

### Notes on the sheet
- 6
- 5
- 4
- 3
- 2
- 1
- D
- Boot Mode Pins
- Align into 3 x 6 header
- Note: Use 2mm pitch jumpers
- C
- Ext Con
- B
- HSEC/Ext Con
- (near R8) GPIO-53 to GPIO-68:
- uSD/Ext Con
- HSEC
- COMPANY:
- A
- PAGE NAME:
- TITLE:
- REV:
- OV Warn
- DATE:
- SIZE:
- SHEET: OF

### Library data of the parts
J1 = HEADER_HSEC8180_EDGE_F28M36X: 180 pin (120 + 60) HSEC8 fingers; mates with samtec connectors; Value: HEADER_HSEC8-180_EDGE; Decal: HEADER_HSEC8_180_EDGE; PCB DECAL: HEADER_HSEC8_180_EDGE
J2-J7 = HEADER_1X3_079: Header Male; 1x3, 2mm pitch; Manufacturer: Harwin Inc; Part Number: M22-2510305; PCB DECAL: HDR1X3_2MM; Decal: HDR1X3_2MM; Digikey: 952-1312-ND; Height: 3.5 (mm); Size: 6 L x 2 W, 2 LS (mm)
R1 R2 = R0402_1%: RES 1/16W 1% 0402 SMD; Decal: R0402; PCB DECAL: R0402
R3-R8 = R0402_5%: RES 1/16W 5% 0402 SMD; Decal: R0402; PCB DECAL: R0402
U1 = MCU_F28379DZWT_337PIN: MCU F2837x 337pin ZWT BGA; Part Number: TMS320F28379DZWT; Decal: TI_ZWT_337BGA; PCB DECAL: TI_ZWT_337BGA

## Sheet ADC.SchDoc: F2837x controlCARD
size 431 x 279 mm; Organization: Texas Instruments; Revision: 1.3
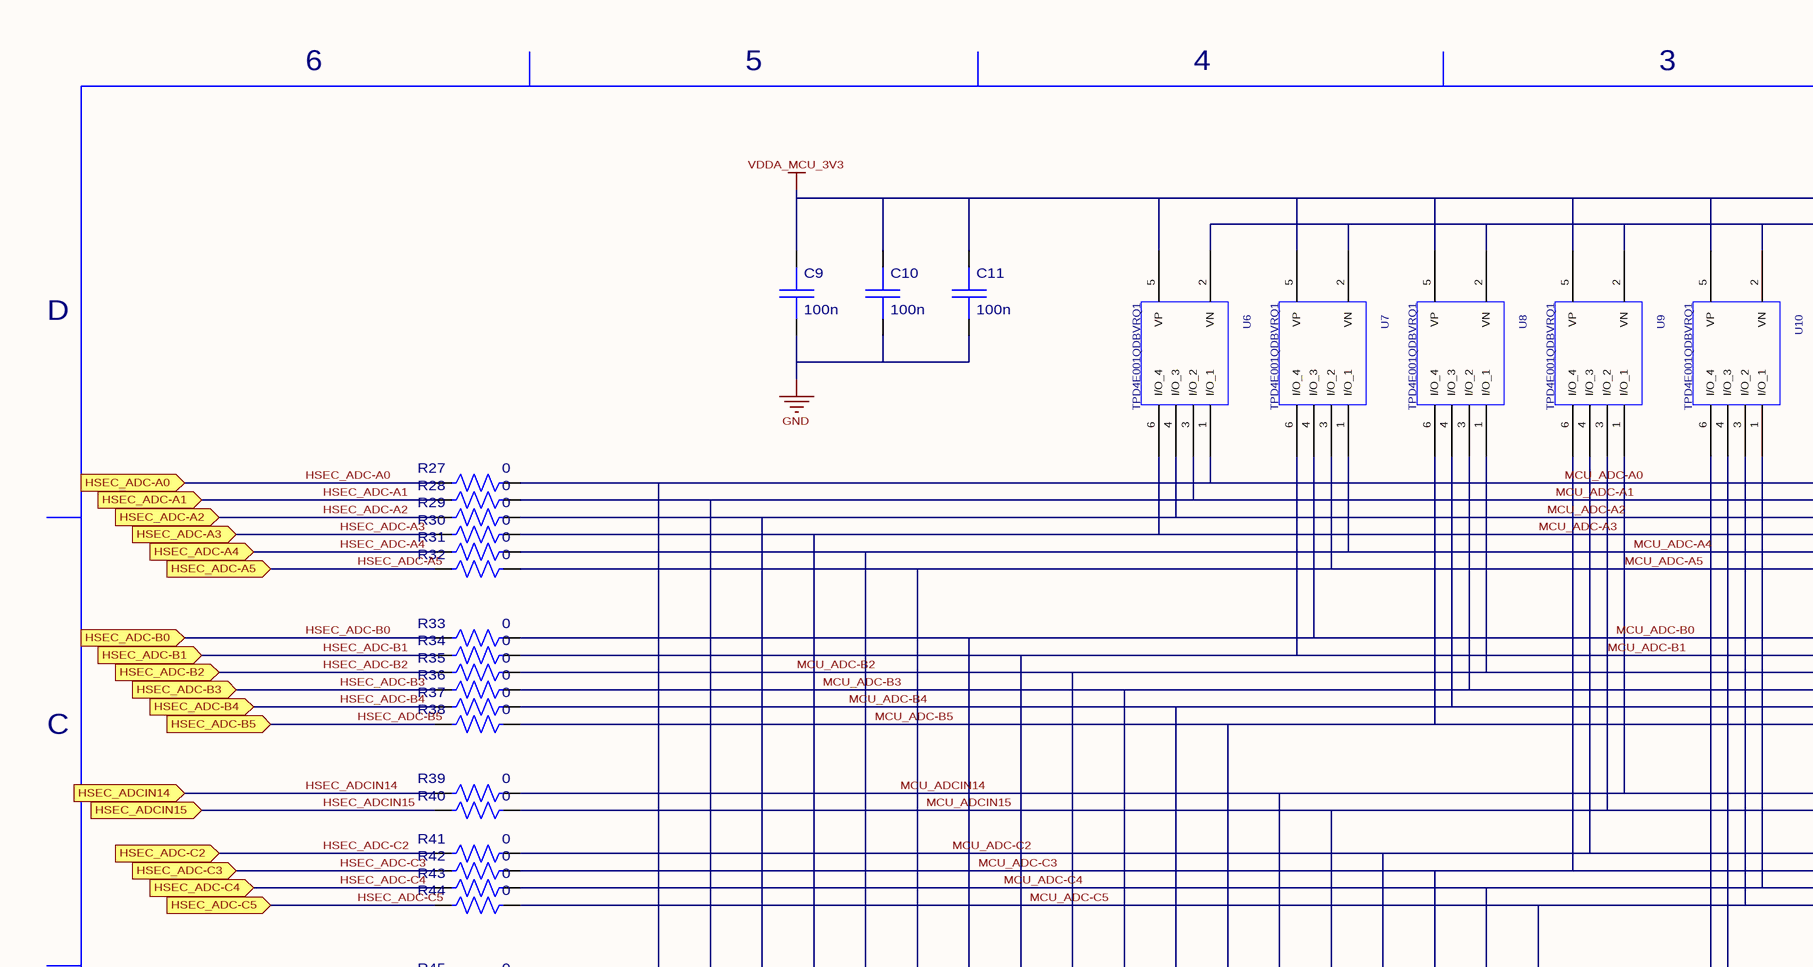
[diagram p7: ADC.SchDoc, top left]
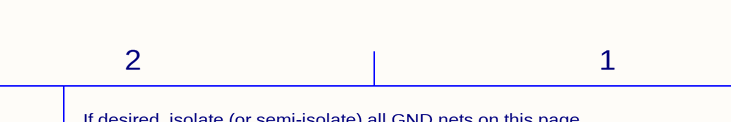
[diagram p8: ADC.SchDoc, top right]
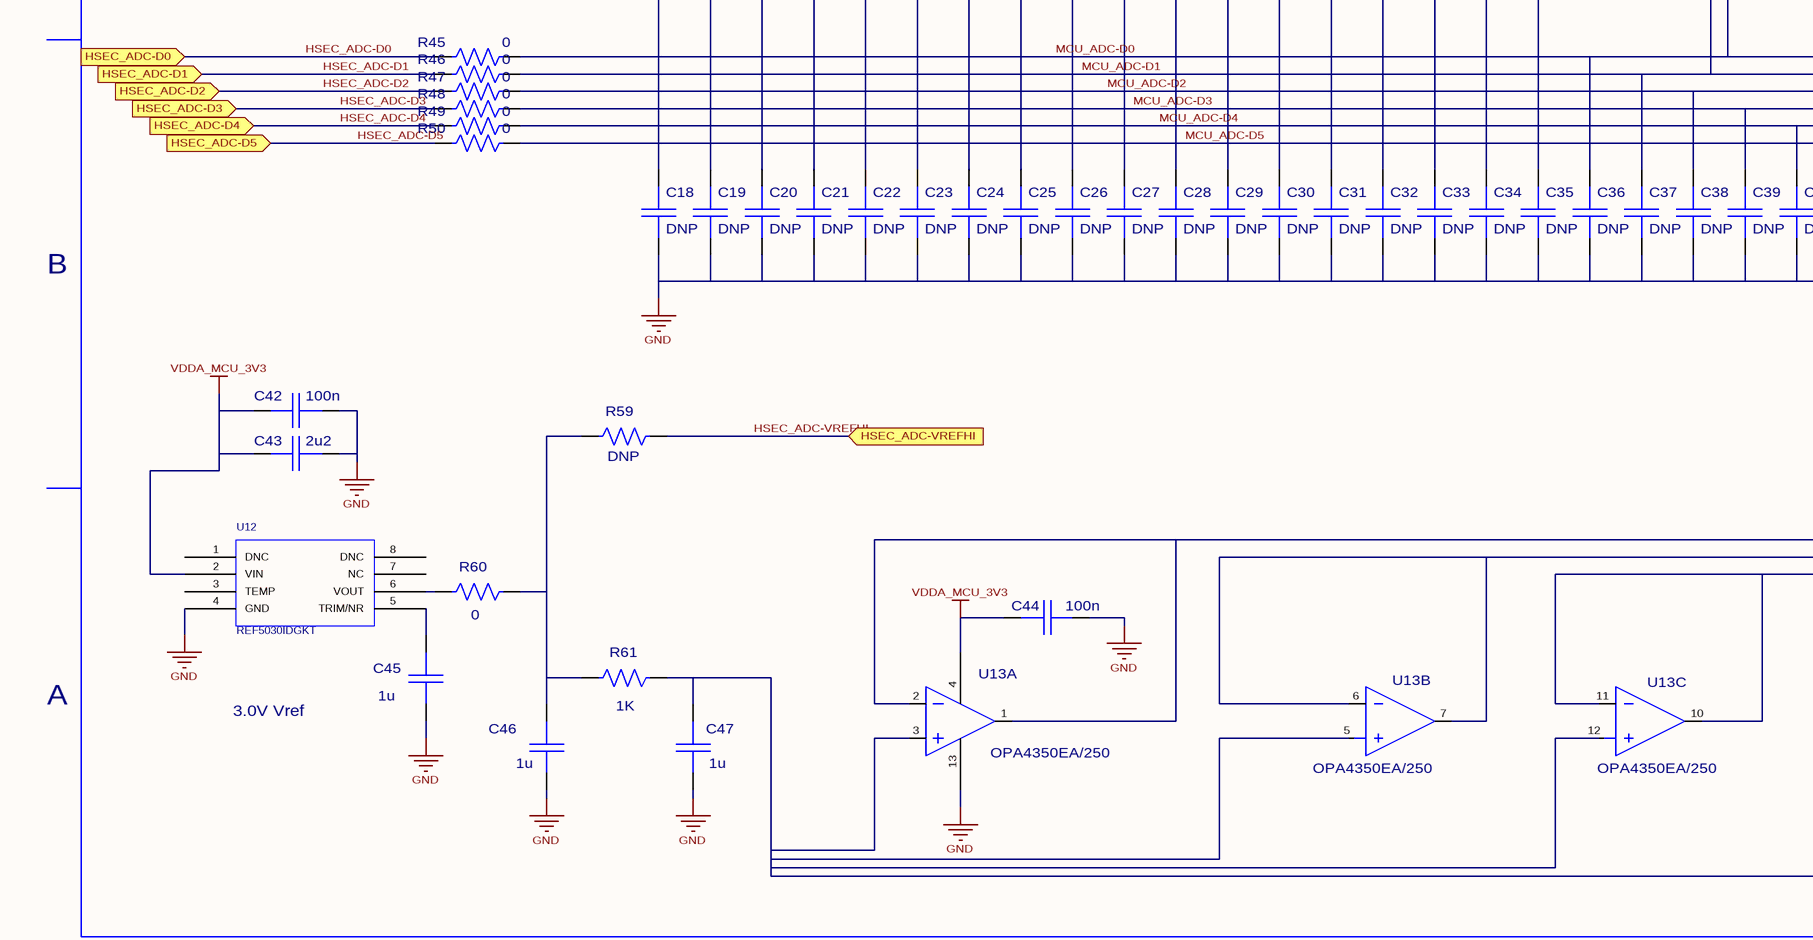
[diagram p9: ADC.SchDoc, bottom left]
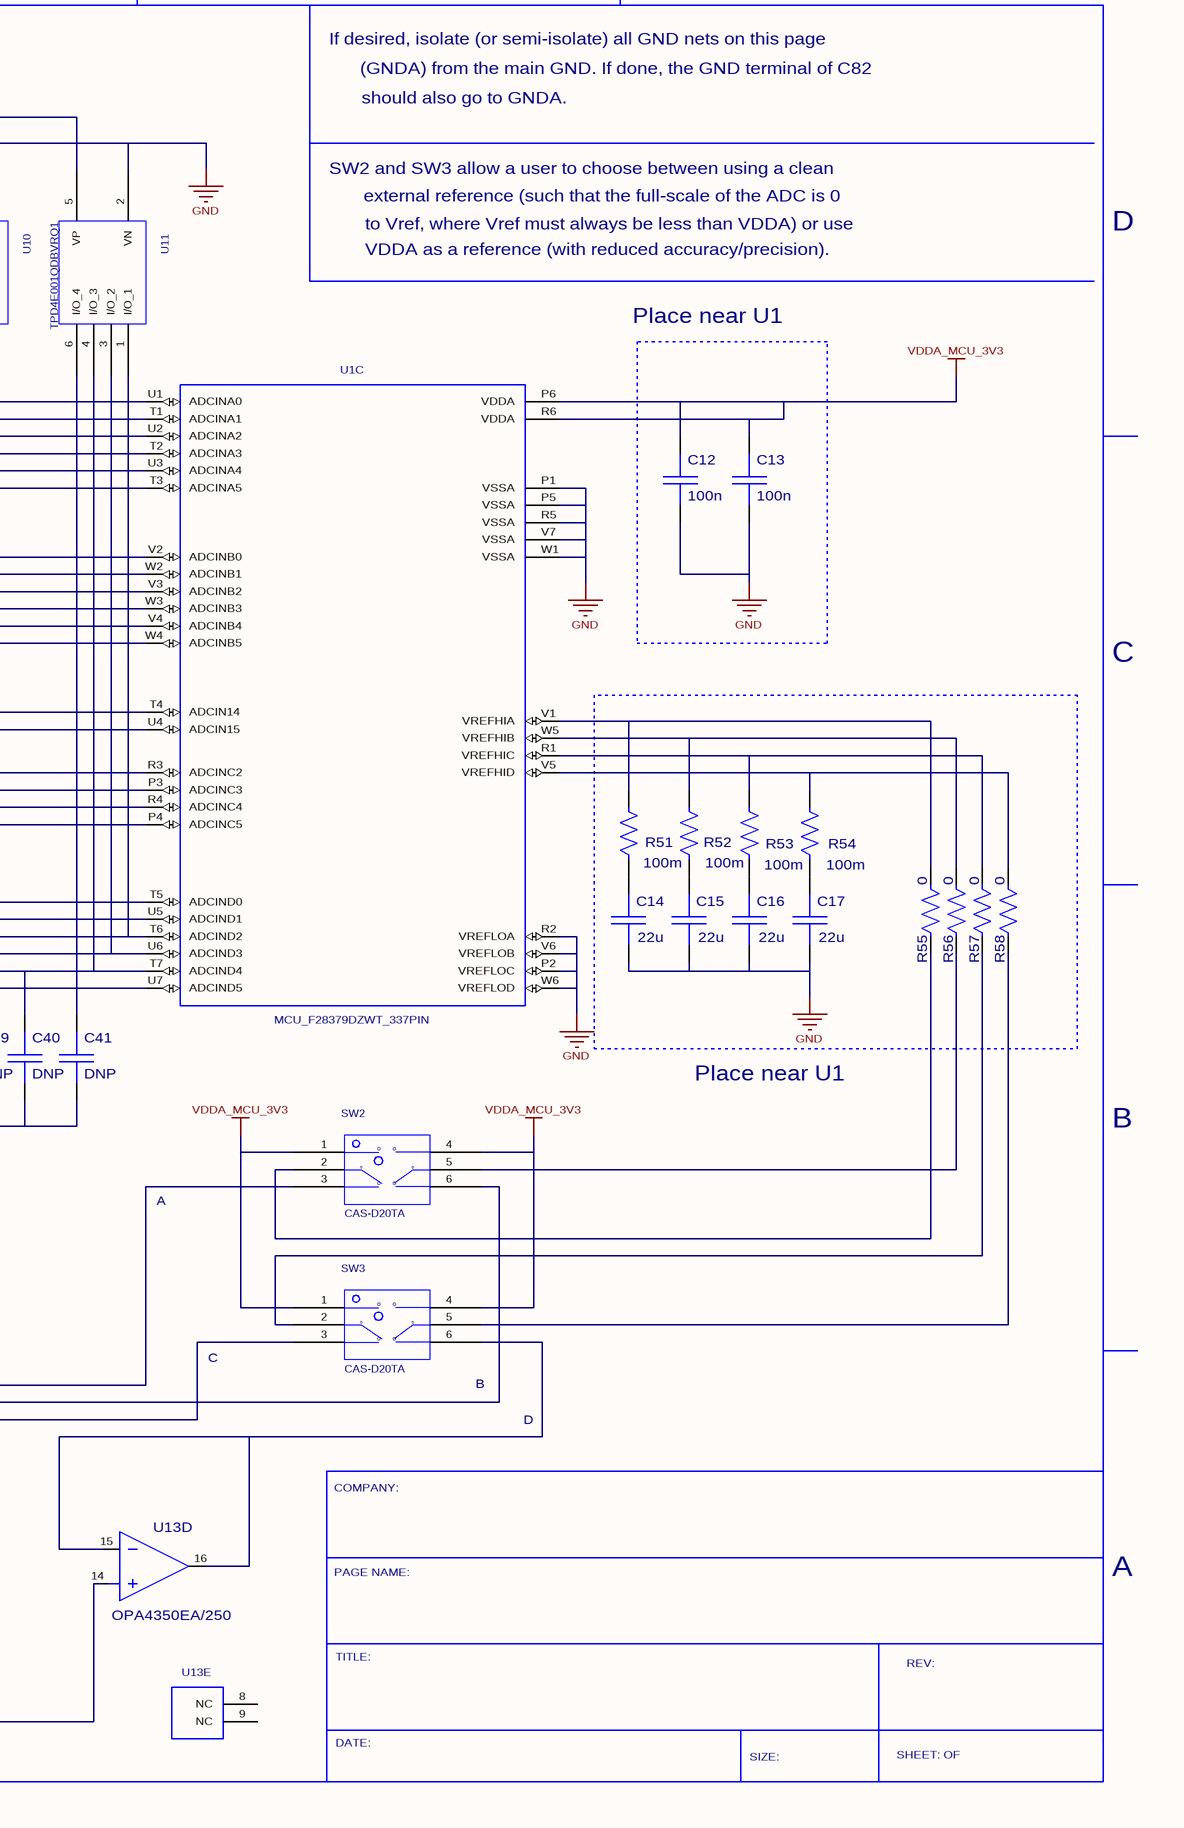
[diagram p10: ADC.SchDoc, bottom right]

### Parts
C9  value 100n  [C0402]  (hidden comment: C0402_16V_X7R)
C10  value 100n  [C0402]  (hidden comment: C0402_16V_X7R)
C11  value 100n  [C0402]  (hidden comment: C0402_16V_X7R)
C12  value 100n  [C0402]  (hidden comment: C0402_16V_X7R)
C13  value 100n  [C0402]  (hidden comment: C0402_16V_X7R)
C14  value 22u  [C0805]  (hidden comment: C0805_16V_X7R)
C15  value 22u  [C0805]  (hidden comment: C0805_16V_X7R)
C16  value 22u  [C0805]  (hidden comment: C0805_16V_X7R)
C17  value 22u  [C0805]  (hidden comment: C0805_16V_X7R)
C18  value DNP  [C0603]  (hidden comment: C0603_16V_X7R)
C19  value DNP  [C0603]  (hidden comment: C0603_16V_X7R)
C20  value DNP  [C0603]  (hidden comment: C0603_16V_X7R)
C21  value DNP  [C0603]  (hidden comment: C0603_16V_X7R)
C22  value DNP  [C0603]  (hidden comment: C0603_16V_X7R)
C23  value DNP  [C0603]  (hidden comment: C0603_16V_X7R)
C24  value DNP  [C0603]  (hidden comment: C0603_16V_X7R)
C25  value DNP  [C0603]  (hidden comment: C0603_16V_X7R)
C26  value DNP  [C0603]  (hidden comment: C0603_16V_X7R)
C27  value DNP  [C0603]  (hidden comment: C0603_16V_X7R)
C28  value DNP  [C0603]  (hidden comment: C0603_16V_X7R)
C29  value DNP  [C0603]  (hidden comment: C0603_16V_X7R)
C30  value DNP  [C0603]  (hidden comment: C0603_16V_X7R)
C31  value DNP  [C0603]  (hidden comment: C0603_16V_X7R)
C32  value DNP  [C0603]  (hidden comment: C0603_16V_X7R)
C33  value DNP  [C0603]  (hidden comment: C0603_16V_X7R)
C34  value DNP  [C0603]  (hidden comment: C0603_16V_X7R)
C35  value DNP  [C0603]  (hidden comment: C0603_16V_X7R)
C36  value DNP  [C0603]  (hidden comment: C0603_16V_X7R)
C37  value DNP  [C0603]  (hidden comment: C0603_16V_X7R)
C38  value DNP  [C0603]  (hidden comment: C0603_16V_X7R)
C39  value DNP  [C0603]  (hidden comment: C0603_16V_X7R)
C40  value DNP  [C0603]  (hidden comment: C0603_16V_X7R)
C41  value DNP  [C0603]  (hidden comment: C0603_16V_X7R)
C42  value 100n  [C0402]  (hidden comment: C0402_16V_X7R)
C43  value 2u2  [C0603]  (hidden comment: C0603_16V_X7R)
C44  value 100n  [C0402]  (hidden comment: C0402_16V_X7R)
C45  value 1u  [C0402]  (hidden comment: C0402_16V_X7R)
C46  value 1u  [C0402]  (hidden comment: C0402_16V_X7R)
C47  value 1u  [C0402]  (hidden comment: C0402_16V_X7R)
R27  value 0  [R0603]  (hidden comment: R0603_5%)
R28  value 0  [R0603]  (hidden comment: R0603_5%)
R29  value 0  [R0603]  (hidden comment: R0603_5%)
R30  value 0  [R0603]  (hidden comment: R0603_5%)
R31  value 0  [R0603]  (hidden comment: R0603_5%)
R32  value 0  [R0603]  (hidden comment: R0603_5%)
R33  value 0  [R0603]  (hidden comment: R0603_5%)
R34  value 0  [R0603]  (hidden comment: R0603_5%)
R35  value 0  [R0603]  (hidden comment: R0603_5%)
R36  value 0  [R0603]  (hidden comment: R0603_5%)
R37  value 0  [R0603]  (hidden comment: R0603_5%)
R38  value 0  [R0603]  (hidden comment: R0603_5%)
R39  value 0  [R0603]  (hidden comment: R0603_5%)
R40  value 0  [R0603]  (hidden comment: R0603_5%)
R41  value 0  [R0603]  (hidden comment: R0603_5%)
R42  value 0  [R0603]  (hidden comment: R0603_5%)
R43  value 0  [R0603]  (hidden comment: R0603_5%)
R44  value 0  [R0603]  (hidden comment: R0603_5%)
R45  value 0  [R0603]  (hidden comment: R0603_5%)
R46  value 0  [R0603]  (hidden comment: R0603_5%)
R47  value 0  [R0603]  (hidden comment: R0603_5%)
R48  value 0  [R0603]  (hidden comment: R0603_5%)
R49  value 0  [R0603]  (hidden comment: R0603_5%)
R50  value 0  [R0603]  (hidden comment: R0603_5%)
R51  value 100m  [R0603]  (hidden comment: R0603_5%)
R52  value 100m  [R0603]  (hidden comment: R0603_5%)
R53  value 100m  [R0603]  (hidden comment: R0603_5%)
R54  value 100m  [R0603]  (hidden comment: R0603_5%)
R55  value 0  [R0402]  (hidden comment: R0402_5%)
R56  value 0  [R0402]  (hidden comment: R0402_5%)
R57  value 0  [R0402]  (hidden comment: R0402_5%)
R58  value 0  [R0402]  (hidden comment: R0402_5%)
R59  value DNP  [R0603]  (hidden comment: R0603_5%)
R60  value 0  [R0603]  (hidden comment: R0603_5%)
R61  value 1K  [R0603]  (hidden comment: R0603_5%)
SW2  value CAS-D20TA  [SWITCH_CAS-D20TA]  (hidden comment: SWITCH_CAS-D20TA)
SW3  value CAS-D20TA  [SWITCH_CAS-D20TA]  (hidden comment: SWITCH_CAS-D20TA)
U1  MCU_F28379DZWT_337PIN  [TI_ZWT_337BGA]  (part C of 5)
U6  TPD4E001QDBVRQ1  [SOT-23-6]
U7  TPD4E001QDBVRQ1  [SOT-23-6]
U8  TPD4E001QDBVRQ1  [SOT-23-6]
U9  TPD4E001QDBVRQ1  [SOT-23-6]
U10  TPD4E001QDBVRQ1  [SOT-23-6]
U11  TPD4E001QDBVRQ1  [SOT-23-6]
U12  value REF5030IDGKT  [MSOP8_DGK]  (hidden comment: IC_REF_REF5030IDGK)
U13  value OPA4350EA/250  [SSOP16_DBQ]  (hidden comment: IC_OPA_OPA4350EA)  (parts A,B,C,D,E of 5)

### Ports
HSEC_ADC-A0, HSEC_ADC-A1, HSEC_ADC-A2, HSEC_ADC-A3, HSEC_ADC-A4, HSEC_ADC-A5, HSEC_ADC-B0, HSEC_ADC-B1, HSEC_ADC-B2, HSEC_ADC-B3, HSEC_ADC-B4, HSEC_ADC-B5, HSEC_ADC-C2, HSEC_ADC-C3, HSEC_ADC-C4, HSEC_ADC-C5, HSEC_ADC-D0, HSEC_ADC-D1, HSEC_ADC-D2, HSEC_ADC-D3, HSEC_ADC-D4, HSEC_ADC-D5, HSEC_ADC-VREFHI, HSEC_ADCIN14, HSEC_ADCIN15

### Nets
GND: C9.1 C10.1 C11.1 C12.1 C13.1 C14.1 C15.1 C16.1 C17.1 C18.1 C19.1 C20.1 C21.1 C22.1 C23.1 C24.1 C25.1 C26.1 C27.1 C28.1 C29.1 C30.1 C31.1 C32.1 C33.1 C34.1 C35.1 C36.1 C37.1 C38.1 C39.1 C40.1 C41.1 C42.2 C43.2 C44.1 C45.1 C46.1 C47.1 U1.P1(VSSA) U1.P2(VREFLOC) U1.P5(VSSA) U1.R2(VREFLOA) U1.R5(VSSA) U1.V6(VREFLOB) U1.V7(VSSA) U1.W1(VSSA) U1.W6(VREFLOD) U6.2(VN) U7.2(VN) U8.2(VN) U9.2(VN) U10.2(VN) U11.2(VN) U12.4(GND) U13.13(V-)
VDDA_MCU_3V3: C9.2 C10.2 C11.2 C12.2 C13.2 C42.1 C43.1 C44.2 SW2.1(A_OUT1) SW2.4(B_IN1) SW3.1(A_OUT1) SW3.4(B_IN1) U1.P6(VDDA) U1.R6(VDDA) U6.5(VP) U7.5(VP) U8.5(VP) U9.5(VP) U10.5(VP) U11.5(VP) U12.2(VIN) U13.4(V+)
HSEC_ADC-A0: R27.1 ; port HSEC_ADC-A0
HSEC_ADC-A1: R28.1 ; port HSEC_ADC-A1
HSEC_ADC-A2: R29.1 ; port HSEC_ADC-A2
HSEC_ADC-A3: R30.1 ; port HSEC_ADC-A3
HSEC_ADC-A4: R31.1 ; port HSEC_ADC-A4
HSEC_ADC-A5: R32.1 ; port HSEC_ADC-A5
HSEC_ADC-B0: R33.1 ; port HSEC_ADC-B0
HSEC_ADC-B1: R34.1 ; port HSEC_ADC-B1
HSEC_ADC-B2: R35.1 ; port HSEC_ADC-B2
HSEC_ADC-B3: R36.1 ; port HSEC_ADC-B3
HSEC_ADC-B4: R37.1 ; port HSEC_ADC-B4
HSEC_ADC-B5: R38.1 ; port HSEC_ADC-B5
HSEC_ADC-C2: R41.1 ; port HSEC_ADC-C2
HSEC_ADC-C3: R42.1 ; port HSEC_ADC-C3
HSEC_ADC-C4: R43.1 ; port HSEC_ADC-C4
HSEC_ADC-C5: R44.1 ; port HSEC_ADC-C5
HSEC_ADC-D0: R45.1 ; port HSEC_ADC-D0
HSEC_ADC-D1: R46.1 ; port HSEC_ADC-D1
HSEC_ADC-D2: R47.1 ; port HSEC_ADC-D2
HSEC_ADC-D3: R48.1 ; port HSEC_ADC-D3
HSEC_ADC-D4: R49.1 ; port HSEC_ADC-D4
HSEC_ADC-D5: R50.1 ; port HSEC_ADC-D5
HSEC_ADC-VREFHI: R59.2 ; port HSEC_ADC-VREFHI
HSEC_ADCIN14: R39.1 ; port HSEC_ADCIN14
HSEC_ADCIN15: R40.1 ; port HSEC_ADCIN15
MCU_ADC-A0: C18.2 R27.2 U1.U1(ADCINA0) U6.1(I/O_1)
MCU_ADC-A1: C19.2 R28.2 U1.T1(ADCINA1) U6.3(I/O_2)
MCU_ADC-A2: C20.2 R29.2 U1.U2(ADCINA2) U6.4(I/O_3)
MCU_ADC-A3: C21.2 R30.2 U1.T2(ADCINA3) U6.6(I/O_4)
MCU_ADC-A4: C22.2 R31.2 U1.U3(ADCINA4) U7.1(I/O_1)
MCU_ADC-A5: C23.2 C30.2 R32.2 R39.2 U1.T3(ADCINA5) U1.T4(ADCIN14) U7.3(I/O_2) U9.1(I/O_1)  [also labelled MCU_ADCIN14]
MCU_ADC-B0: C24.2 R33.2 U1.V2(ADCINB0) U7.4(I/O_3)
MCU_ADC-B1: C25.2 C31.2 R34.2 R40.2 U1.U4(ADCIN15) U1.W2(ADCINB1) U7.6(I/O_4) U9.3(I/O_2)  [also labelled MCU_ADCIN15]
MCU_ADC-B2: C26.2 R35.2 U1.V3(ADCINB2) U8.1(I/O_1)
MCU_ADC-B3: C27.2 R36.2 U1.W3(ADCINB3) U8.3(I/O_2)
MCU_ADC-B4: C28.2 R37.2 U1.V4(ADCINB4) U8.4(I/O_3)
MCU_ADC-B5: C29.2 R38.2 U1.W4(ADCINB5) U8.6(I/O_4)
MCU_ADC-C2: C32.2 R41.2 U1.R3(ADCINC2) U9.4(I/O_3)
MCU_ADC-C3: C33.2 R42.2 U1.P3(ADCINC3) U9.6(I/O_4)
MCU_ADC-C4: C34.2 R43.2 U1.R4(ADCINC4) U10.1(I/O_1)
MCU_ADC-C5: C35.2 R44.2 U1.P4(ADCINC5) U10.3(I/O_2)
MCU_ADC-D0: C36.2 R45.2 U1.T5(ADCIND0) U10.4(I/O_3)
MCU_ADC-D1: C37.2 R46.2 U1.U5(ADCIND1) U10.6(I/O_4)
MCU_ADC-D2: C38.2 R47.2 U1.T6(ADCIND2) U11.1(I/O_1)
MCU_ADC-D3: C39.2 R48.2 U1.U6(ADCIND3) U11.3(I/O_2)
MCU_ADC-D4: C40.2 R49.2 U1.T7(ADCIND4) U11.4(I/O_3)
MCU_ADC-D5: C41.2 R50.2 U1.U7(ADCIND5) U11.6(I/O_4)
NetC14_2: C14.2 R51.1
NetC15_2: C15.2 R52.1
NetC16_2: C16.2 R53.1
NetC17_2: C17.2 R54.1
NetC45_2: C45.2 U12.5(TRIM/NR)
NetC46_2: C46.2 R59.1 R60.2 R61.2
NetC47_2: C47.2 R61.1 U13.3(+A) U13.5(+B) U13.12(+C) U13.14(+D)
NetR51_2: R51.2 R55.2 U1.V1(VREFHIA)
NetR52_2: R52.2 R56.2 U1.W5(VREFHIB)
NetR53_2: R53.2 R57.2 U1.R1(VREFHIC)
NetR54_2: R54.2 R58.2 U1.V5(VREFHID)
NetR55_1: R55.1 SW2.2(A_IN)
NetR56_1: R56.1 SW2.5(B_IN)
NetR57_1: R57.1 SW3.2(A_IN)
NetR58_1: R58.1 SW3.5(B_IN)
NetR60_1: R60.1 U12.6(VOUT)
NetSW2_3: SW2.3(A_OUT2) U13.1(OUTA) U13.2(-A)
NetSW2_6: SW2.6(B_IN2) U13.6(-B) U13.7(OUTB)
NetSW3_3: SW3.3(A_OUT2) U13.10(OUTC) U13.11(-C)
NetSW3_6: SW3.6(B_IN2) U13.15(-D) U13.16(OUTD)

Not connected (* = marked no-connect by the designer): U12 1(DNC) 3(TEMP) 7(NC) 8(DNC); U13 8(NC) 9(NC)

### Notes on the sheet
- 6
- 5
- 4
- 3
- If desired, isolate (or semi-isolate) all GND nets on this page
- 2
- 1
- (GNDA) from the main GND. If done, the GND terminal of C82
- should also go to GNDA.
- SW2 and SW3 allow a user to choose between using a clean
- external reference (such that the full-scale of the ADC is 0
- to Vref, where Vref must always be less than VDDA) or use
- D
- VDDA as a reference (with reduced accuracy/precision).
- Place near U1
- C
- B
- A
- (near SW3) B
- COMPANY:
- 3.0V Vref
- PAGE NAME:
- TITLE:
- REV:
- DATE:
- SIZE:
- SHEET: OF
- (in symbol SWITCH_CAS-D20TA) o

### Library data of the parts
C9-C13 C42 C44 = C0402_16V_X7R: CAP CER 16V 10% X7R 0402; Decal: C0402; PCB DECAL: C0402
C14-C17 = C0805_16V_X7R: CAP CER 10V 20% X5R/X7S 0805; Decal: C0805; PCB DECAL: C0805
C18-C41 = C0603_16V_X7R: CAP CER 16V 10% X7R 0603; Decal: C0603; PCB DECAL: C0603
C43 = C0603_16V_X7R: CAP CER 10V 20% X5R 0603; Decal: C0603; PCB DECAL: C0603
C45-C47 = C0402_16V_X7R: CAP CER 6.3V 10% X7R 0402; Decal: C0402; PCB DECAL: C0402
R27-R54 R59-R61 = R0603_5%: RES 1/10W 5% 0603 SMD; Decal: R0603; PCB DECAL: R0603
R55-R58 = R0402_5%: RES 1/16W 5% 0402 SMD; Decal: R0402; PCB DECAL: R0402
SW2 SW3 = SWITCH_CAS-D20TA: Switch SPDT, 2 position; Manufacturer: Copal Electronics; Decal: SW-CAS-D20TA; Digikey: CASD20JCT-ND; Height: 2.5 (mm); Part Number: CAS-D20TA; Size: 5.4 L x 4.2 W, 1.75 LS (mm); PCB DECAL: SWITCH_CAS-D20TA
U1 = MCU_F28379DZWT_337PIN: as U1 on sheet GPIO,CONNECTOR; Decal: TI_ZWT_337BGA; PCB DECAL: TI_ZWT_337BGA
U6-U11 = TPD4E001QDBVRQ1: TVS 4-ch UniDir Diode Array: VCC & GND prot, 11V brkdwn; Manufacturer: Texas Instruments; Decal: SOT-23-6; Digikey: 296-39344-1-ND; Part Number: TPD4E001QDBVRQ1; Value: TPD4E001QDBVRQ1; PCB DECAL: SOT-23-6
U12 = IC_REF_REF5030IDGK: IC, 3.0V Vref, 0.05%, 8DGK; Decal: MSOP8_DGK; Digikey: 296-24501-1-ND; Part Number: REF5030IDGKT; PCB DECAL: MSOP8_DGK
U13 = IC_OPA_OPA4350EA: IC OPAMP GP R-R 38MHZ QUAD 16DBQ; Decal: SSOP16-DBQ; Digikey: OPA4350EACT-ND; Part Number: OPA4350EA/250; PCB DECAL: SSOP16_DBQ

## Sheet POWER.SchDoc: F2837x controlCARD
size 431 x 279 mm; Organization: Texas Instruments; Revision: 1.3
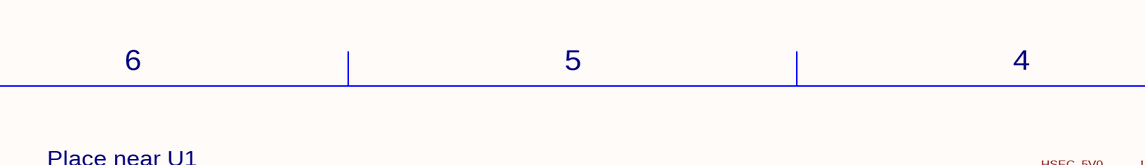
[diagram p11: POWER.SchDoc, top left]
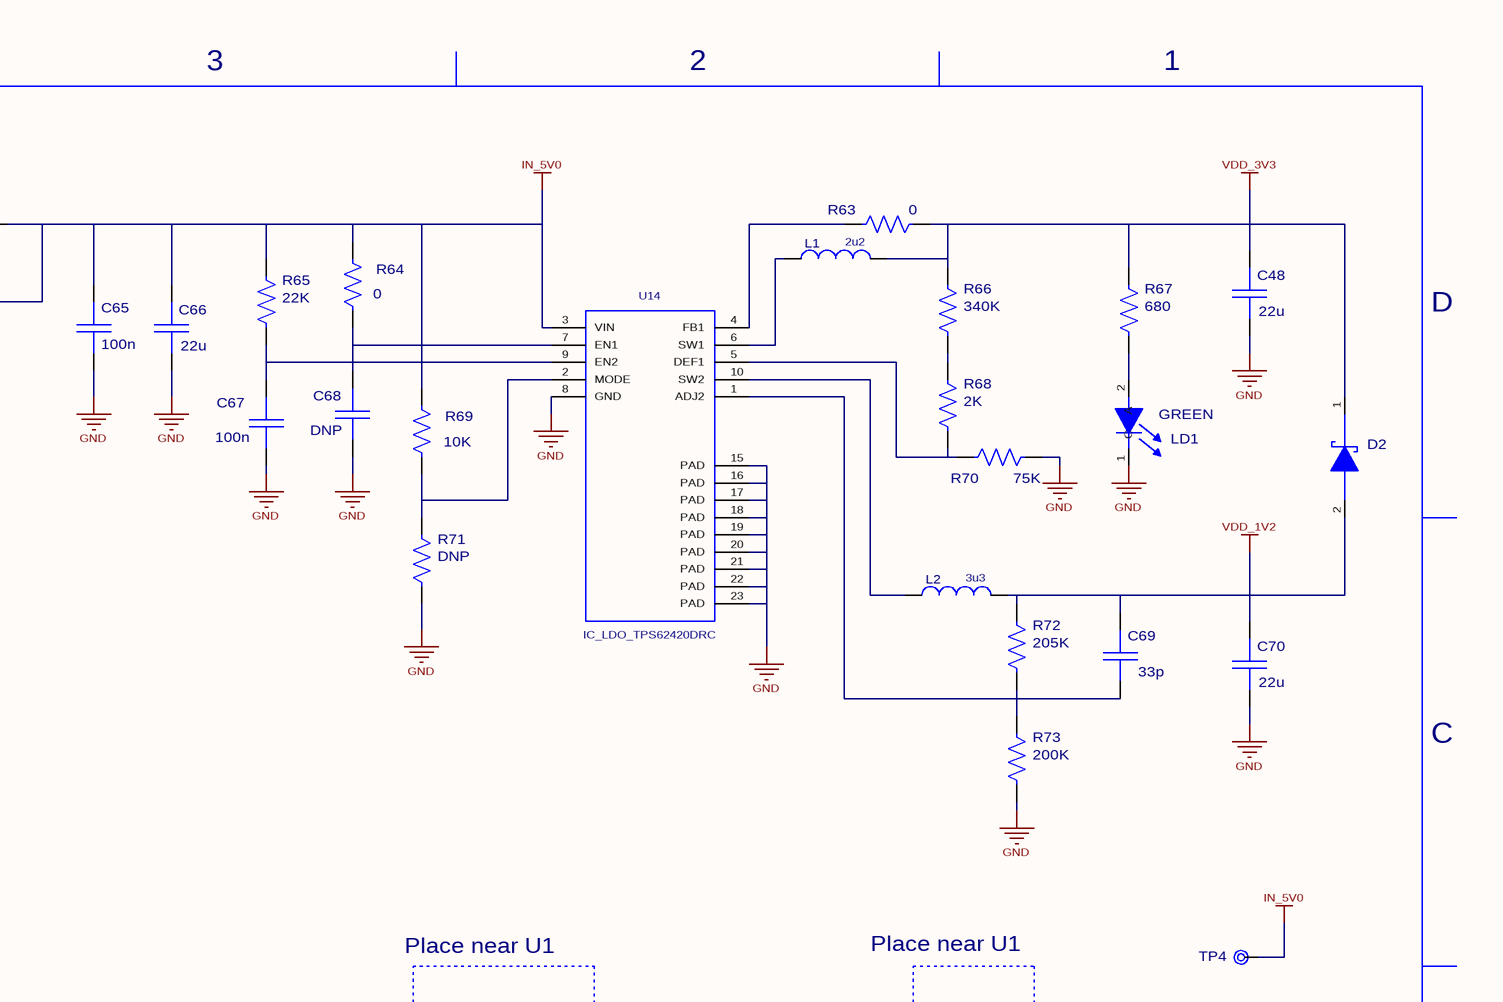
[diagram p12: POWER.SchDoc, top right]
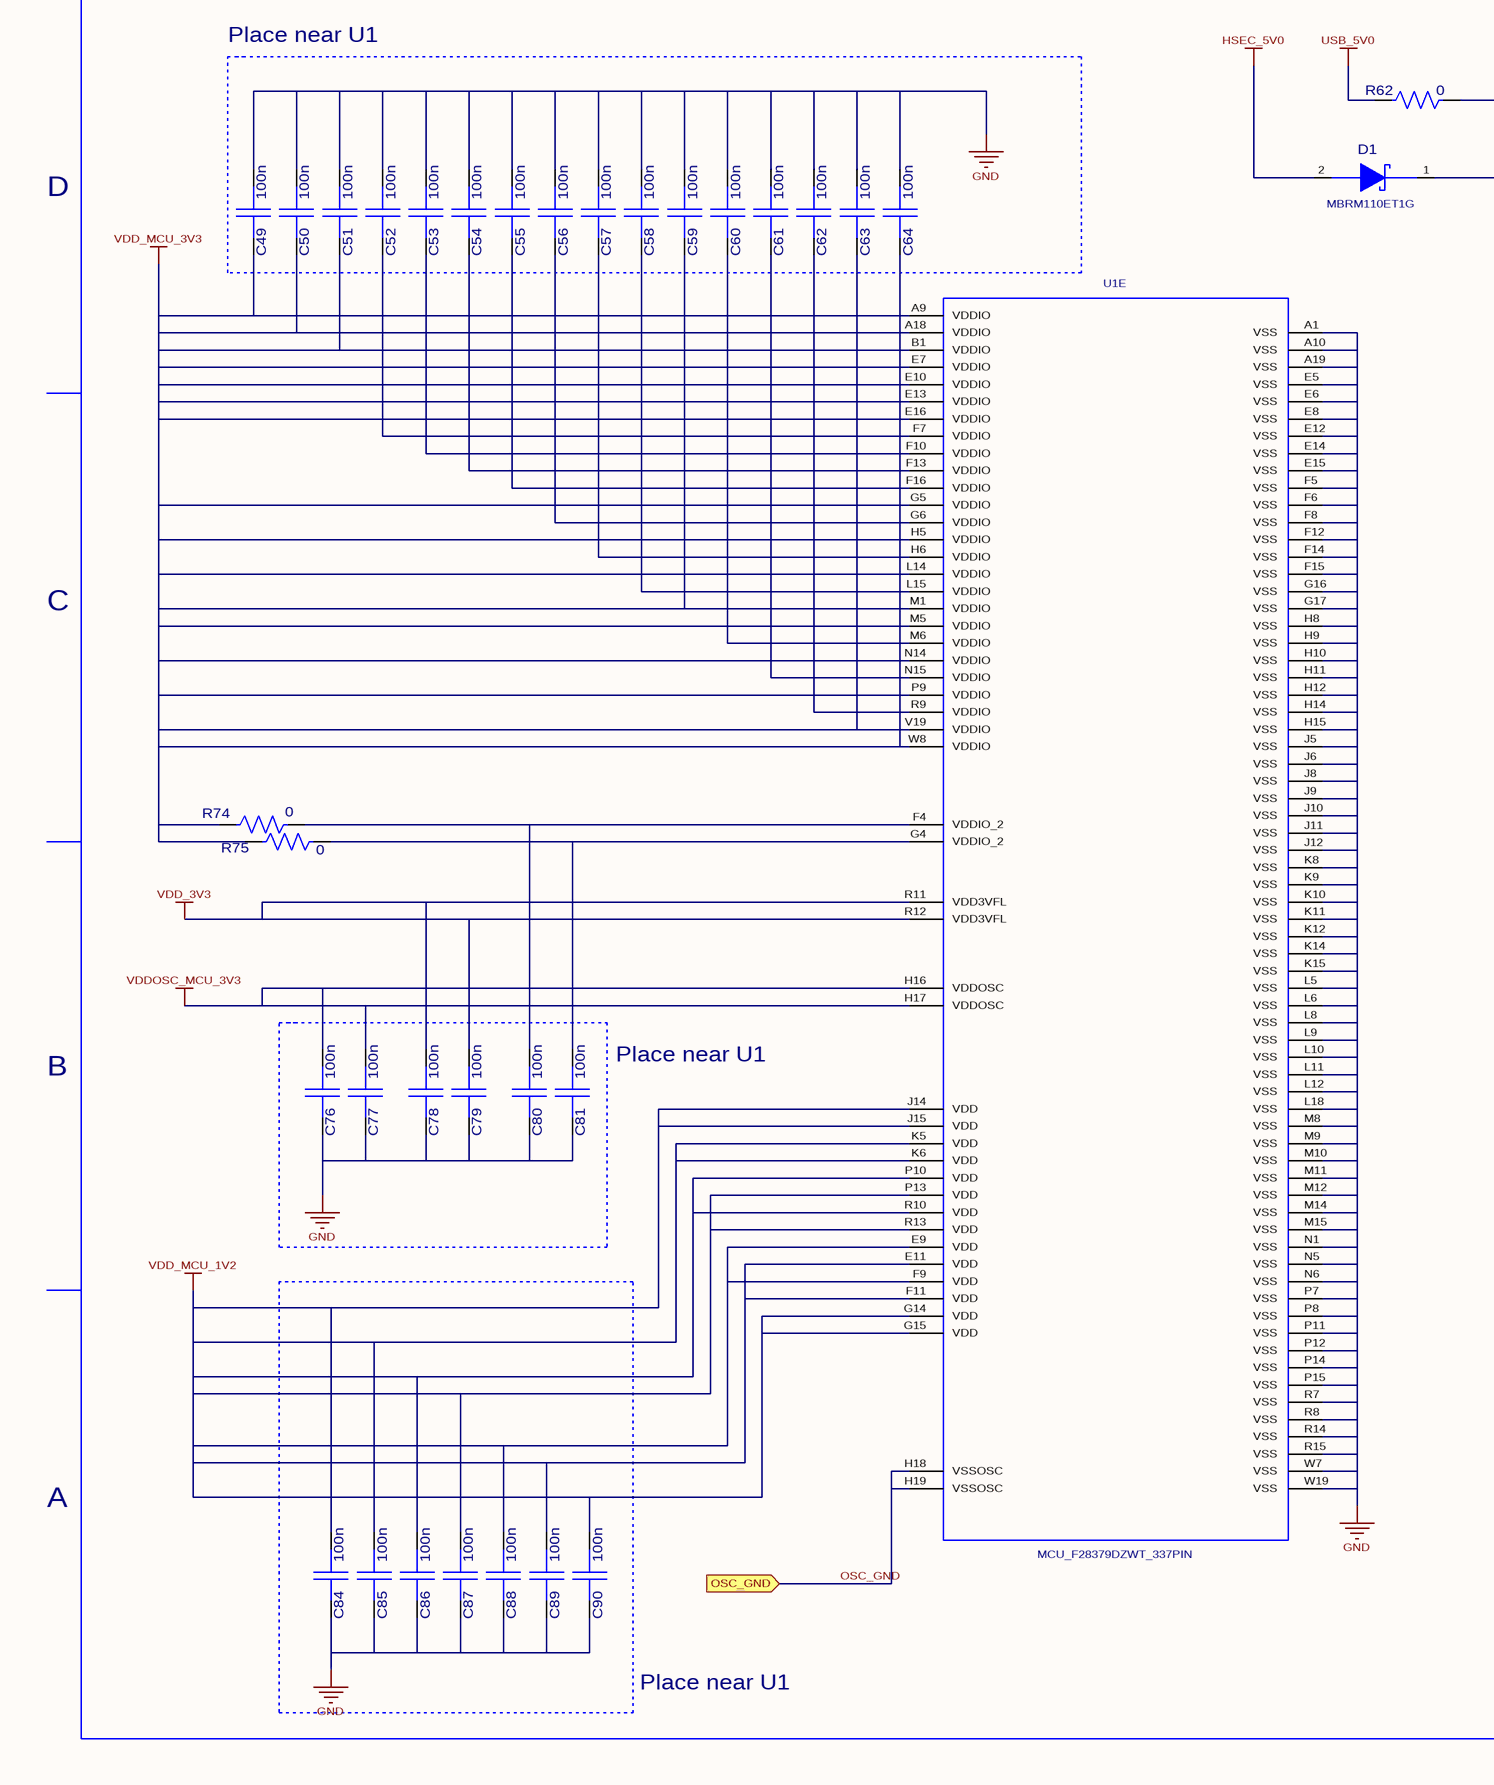
[diagram p13: POWER.SchDoc, bottom left]
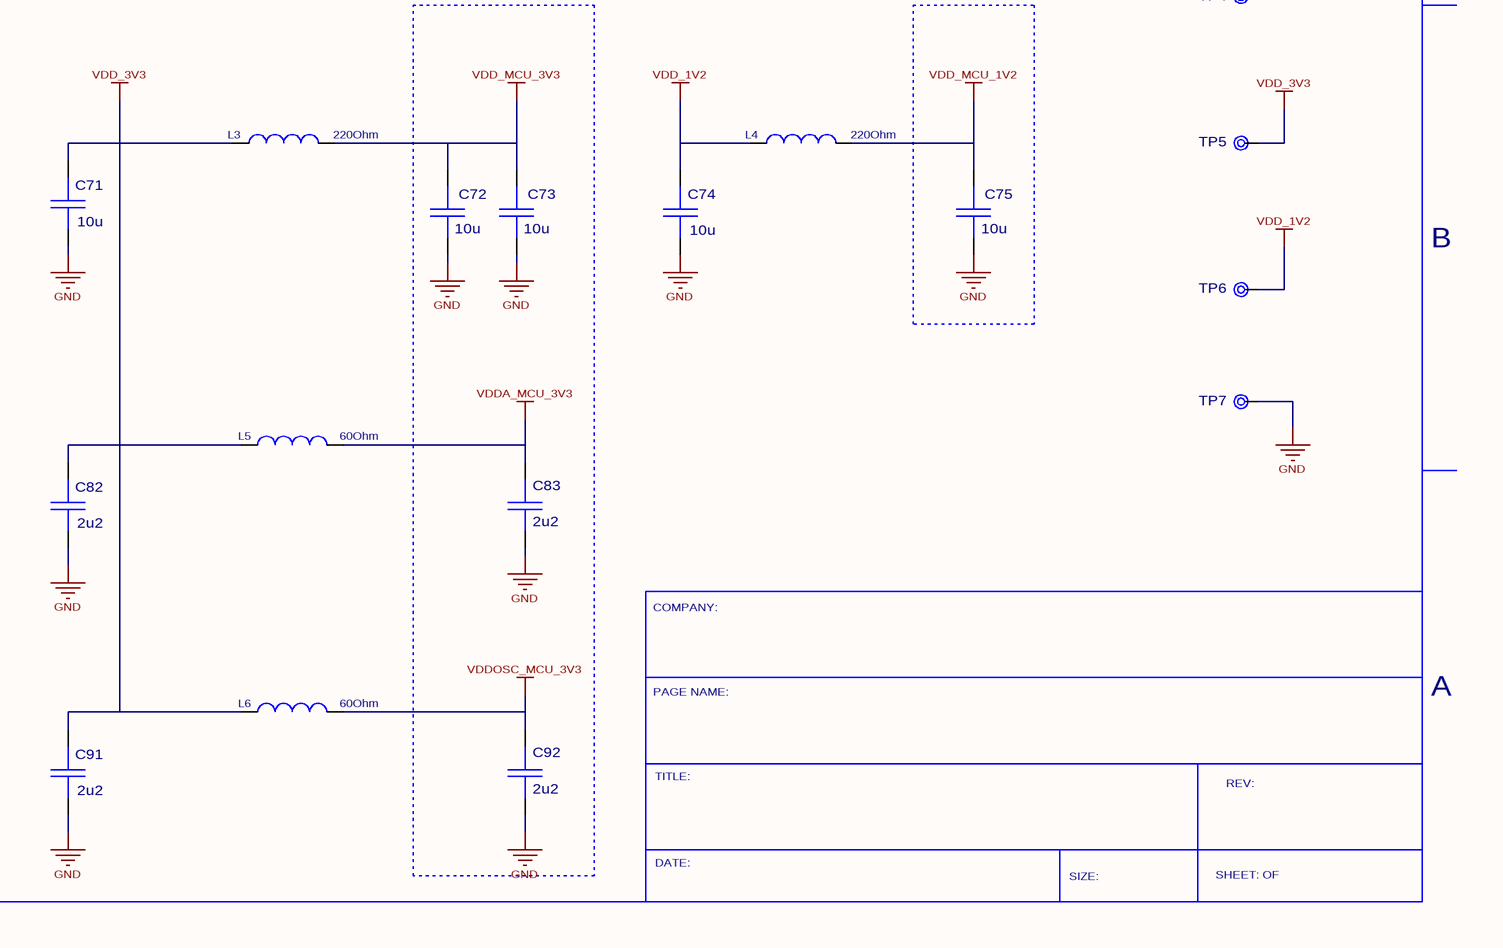
[diagram p14: POWER.SchDoc, bottom right]

### Parts
C48  value 22u  [C0805]  (hidden comment: C0805_16V_X7R)
C49  value 100n  [C0402]  (hidden comment: C0402_16V_X7R)
C50  value 100n  [C0402]  (hidden comment: C0402_16V_X7R)
C51  value 100n  [C0402]  (hidden comment: C0402_16V_X7R)
C52  value 100n  [C0402]  (hidden comment: C0402_16V_X7R)
C53  value 100n  [C0402]  (hidden comment: C0402_16V_X7R)
C54  value 100n  [C0402]  (hidden comment: C0402_16V_X7R)
C55  value 100n  [C0402]  (hidden comment: C0402_16V_X7R)
C56  value 100n  [C0402]  (hidden comment: C0402_16V_X7R)
C57  value 100n  [C0402]  (hidden comment: C0402_16V_X7R)
C58  value 100n  [C0402]  (hidden comment: C0402_16V_X7R)
C59  value 100n  [C0402]  (hidden comment: C0402_16V_X7R)
C60  value 100n  [C0402]  (hidden comment: C0402_16V_X7R)
C61  value 100n  [C0402]  (hidden comment: C0402_16V_X7R)
C62  value 100n  [C0402]  (hidden comment: C0402_16V_X7R)
C63  value 100n  [C0402]  (hidden comment: C0402_16V_X7R)
C64  value 100n  [C0402]  (hidden comment: C0402_16V_X7R)
C65  value 100n  [C0402]  (hidden comment: C0402_16V_X7R)
C66  value 22u  [C0805]  (hidden comment: C0805_16V_X7R)
C67  value 100n  [C0402]  (hidden comment: C0402_16V_X7R)
C68  value DNP  [C0402]  (hidden comment: C0402_16V_X7R)
C69  value 33p  [C0402]  (hidden comment: C0402_50V_NP0)
C70  value 22u  [C0805]  (hidden comment: C0805_16V_X7R)
C71  value 10u  [C0805]  (hidden comment: C0805_16V_X7R)
C72  value 10u  [C0603]  (hidden comment: C0603_16V_X7R)
C73  value 10u  [C0603]  (hidden comment: C0603_16V_X7R)
C74  value 10u  [C0805]  (hidden comment: C0805_16V_X7R)
C75  value 10u  [C0603]  (hidden comment: C0603_16V_X7R)
C76  value 100n  [C0402]  (hidden comment: C0402_16V_X7R)
C77  value 100n  [C0402]  (hidden comment: C0402_16V_X7R)
C78  value 100n  [C0402]  (hidden comment: C0402_16V_X7R)
C79  value 100n  [C0402]  (hidden comment: C0402_16V_X7R)
C80  value 100n  [C0402]  (hidden comment: C0402_16V_X7R)
C81  value 100n  [C0402]  (hidden comment: C0402_16V_X7R)
C82  value 2u2  [C0805]  (hidden comment: C0805_16V_X7R)
C83  value 2u2  [C0603]  (hidden comment: C0603_16V_X7R)
C84  value 100n  [C0402]  (hidden comment: C0402_16V_X7R)
C85  value 100n  [C0402]  (hidden comment: C0402_16V_X7R)
C86  value 100n  [C0402]  (hidden comment: C0402_16V_X7R)
C87  value 100n  [C0402]  (hidden comment: C0402_16V_X7R)
C88  value 100n  [C0402]  (hidden comment: C0402_16V_X7R)
C89  value 100n  [C0402]  (hidden comment: C0402_16V_X7R)
C90  value 100n  [C0402]  (hidden comment: C0402_16V_X7R)
C91  value 2u2  [C0805]  (hidden comment: C0805_16V_X7R)
C92  value 2u2  [C0603]  (hidden comment: C0603_16V_X7R)
D1  Part Number: MBRM110ET1G  [DO-216AA]  (hidden comment: DIODE_SCHOTTKY_MBRM110ET1G)
D2  DIODE_SCHOTTKY_CFSH05-20L  [SOD882L]  (value not drawn)
L1  value 2u2  [IND_SMD_VLF3010A_COILS]  (hidden comment: IND_VLF3010AT-2R2M1R0)
L2  value 3u3  [IND_SMD_VLF3010A_COILS]  (hidden comment: IND_VLF3010AT-3R3MR87)
L3  value 220Ohm  [L0805]  (hidden comment: L0805_BLM21PG221SN1D)
L4  value 220Ohm  [L0805]  (hidden comment: L0805_BLM21PG221SN1D)
L5  value 60Ohm  [L0805]  (hidden comment: L0805_BKP2125HS600-T)
L6  value 60Ohm  [L0805]  (hidden comment: L0805_BKP2125HS600-T)
LD1  value GREEN  [LED0805]  (hidden comment: LED0805_GREEN)
R62  value 0  [R0805]  (hidden comment: R0805_5%)
R63  value 0  [R0402]  (hidden comment: R0402_5%)
R64  value 0  [R0402]  (hidden comment: R0402_5%)
R65  value 22K  [R0402]  (hidden comment: R0402_1%)
R66  value 340K  [R0402]  (hidden comment: R0402_1%)
R67  value 680  [R0402]  (hidden comment: R0402_5%)
R68  value 2K  [R0402]  (hidden comment: R0402_1%)
R69  value 10K  [R0402]  (hidden comment: R0402_5%)
R70  value 75K  [R0402]  (hidden comment: R0402_1%)
R71  value DNP  [R0603]  (hidden comment: R0603_5%)
R72  value 205K  [R0402]  (hidden comment: R0402_1%)
R73  value 200K  [R0402]  (hidden comment: R0402_1%)
R74  value 0  [R0603]  (hidden comment: R0603_5%)
R75  value 0  [R0603]  (hidden comment: R0603_5%)
TP4  VIA_20_40  [VIA_20_40]  (value not drawn)
TP5  VIA_20_40  [VIA_20_40]  (value not drawn)
TP6  VIA_20_40  [VIA_20_40]  (value not drawn)
TP7  VIA_20_40  [VIA_20_40]  (value not drawn)
U1  MCU_F28379DZWT_337PIN  [TI_ZWT_337BGA]  (part E of 5)
U14  IC_LDO_TPS62420DRC  [TI_DRC_10]

### Ports
OSC_GND

### Nets
GND: C48.1 C49.2 C50.2 C51.2 C52.2 C53.2 C54.2 C55.2 C56.2 C57.2 C58.2 C59.2 C60.2 C61.2 C62.2 C63.2 C64.2 C65.1 C66.1 C67.1 C68.1 C70.1 C71.1 C72.1 C73.1 C74.1 C75.1 C76.1 C77.1 C78.1 C79.1 C80.1 C81.1 C82.1 C83.1 C84.1 C85.1 C86.1 C87.1 C88.1 C89.1 C90.1 C91.1 C92.1 LD1.1(C) R70.2 R71.2 R73.2 TP7.1 U1.A1(VSS) U1.A10(VSS) U1.A19(VSS) U1.E5(VSS) U1.E6(VSS) U1.E8(VSS) U1.E12(VSS) U1.E14(VSS) U1.E15(VSS) U1.F5(VSS) U1.F6(VSS) U1.F8(VSS) U1.F12(VSS) U1.F14(VSS) U1.F15(VSS) U1.G16(VSS) U1.G17(VSS) U1.H8(VSS) U1.H9(VSS) U1.H10(VSS) U1.H11(VSS) U1.H12(VSS) U1.H14(VSS) U1.H15(VSS) U1.J5(VSS) U1.J6(VSS) U1.J8(VSS) U1.J9(VSS) U1.J10(VSS) U1.J11(VSS) U1.J12(VSS) U1.K8(VSS) U1.K9(VSS) U1.K10(VSS) U1.K11(VSS) U1.K12(VSS) U1.K14(VSS) U1.K15(VSS) U1.L5(VSS) U1.L6(VSS) U1.L8(VSS) U1.L9(VSS) U1.L10(VSS) U1.L11(VSS) U1.L12(VSS) U1.L18(VSS) U1.M8(VSS) U1.M9(VSS) U1.M10(VSS) U1.M11(VSS) U1.M12(VSS) U1.M14(VSS) U1.M15(VSS) U1.N1(VSS) U1.N5(VSS) U1.N6(VSS) U1.P7(VSS) U1.P8(VSS) U1.P11(VSS) U1.P12(VSS) U1.P14(VSS) U1.P15(VSS) U1.R7(VSS) U1.R8(VSS) U1.R14(VSS) U1.R15(VSS) U1.W7(VSS) U1.W19(VSS) U14.8(GND) U14.15(PAD) U14.16(PAD) U14.17(PAD) U14.18(PAD) U14.19(PAD) U14.20(PAD) U14.21(PAD) U14.22(PAD) U14.23(PAD)
HSEC_5V0: D1.2(A)  [project net MCU_GPIO-42]
IN_5V0: C65.2 C66.2 D1.1(C) R62.2 R64.2 R65.1 R69.2 TP4.1 U14.3(VIN)
USB_5V0: R62.1
VDD_1V2: C69.2 C70.2 C74.2 D2.2(A) L2.2 L4.1 R72.1 TP6.1
VDD_3V3: C48.2 C71.2 C78.2 C79.2 C82.2 C91.2 D2.1(C) L1.2 L3.1 L5.1 L6.1 R63.1 R66.1 R67.1 TP5.1 U1.R11(VDD3VFL) U1.R12(VDD3VFL)
VDD_MCU_1V2: C75.2 C84.2 C85.2 C86.2 C87.2 C88.2 C89.2 C90.2 L4.2 U1.E9(VDD) U1.E11(VDD) U1.F9(VDD) U1.F11(VDD) U1.G14(VDD) U1.G15(VDD) U1.J14(VDD) U1.J15(VDD) U1.K5(VDD) U1.K6(VDD) U1.P10(VDD) U1.P13(VDD) U1.R10(VDD) U1.R13(VDD)
VDD_MCU_3V3: C49.1 C50.1 C51.1 C52.1 C53.1 C54.1 C55.1 C56.1 C57.1 C58.1 C59.1 C60.1 C61.1 C62.1 C63.1 C64.1 C72.2 C73.2 L3.2 R74.1 R75.1 U1.A9(VDDIO) U1.A18(VDDIO) U1.B1(VDDIO) U1.E7(VDDIO) U1.E10(VDDIO) U1.E13(VDDIO) U1.E16(VDDIO) U1.F7(VDDIO) U1.F10(VDDIO) U1.F13(VDDIO) U1.F16(VDDIO) U1.G5(VDDIO) U1.G6(VDDIO) U1.H5(VDDIO) U1.H6(VDDIO) U1.L14(VDDIO) U1.L15(VDDIO) U1.M1(VDDIO) U1.M5(VDDIO) U1.M6(VDDIO) U1.N14(VDDIO) U1.N15(VDDIO) U1.P9(VDDIO) U1.R9(VDDIO) U1.V19(VDDIO) U1.W8(VDDIO)
VDDA_MCU_3V3: C83.2 L5.2
VDDOSC_MCU_3V3: C76.2 C77.2 C92.2 L6.2 U1.H16(VDDOSC) U1.H17(VDDOSC)
OSC_GND: U1.H18(VSSOSC) U1.H19(VSSOSC) ; port OSC_GND
NetC67_2: C67.2 R65.2 U14.9(EN2)
NetC68_2: C68.2 R64.1 U14.7(EN1)
NetC69_1: C69.1 R72.2 R73.1 U14.1(ADJ2)
NetC80_2: C80.2 R74.2 U1.F4(VDDIO_2)
NetC81_2: C81.2 R75.2 U1.G4(VDDIO_2)
NetL1_1: L1.1 U14.6(SW1)
NetL2_1: L2.1 U14.10(SW2)
NetLD1_2: LD1.2(A) R67.2
NetR63_2: R63.2 U14.4(FB1)
NetR66_2: R66.2 R68.1
NetR68_2: R68.2 R70.1 U14.5(DEF1)
NetR69_1: R69.1 R71.1 U14.2(MODE)

### Notes on the sheet
- 6
- 5
- 4
- 3
- 2
- 1
- Place near U1
- D
- C
- B
- (near C81) Place near U1
- COMPANY:
- A
- PAGE NAME:
- TITLE:
- REV:
- DATE:
- SIZE:
- SHEET: OF

### Library data of the parts
C48 C66 C70 = C0805_16V_X7R: CAP CER 6.3V 20% X5R 0805; Decal: C0805; PCB DECAL: C0805
C49-C65 C67 C68 C76-C81 C84-C90 = C0402_16V_X7R: CAP CER 16V 10% X7R 0402; Decal: C0402; PCB DECAL: C0402
C69 = C0402_50V_NP0: CAP CER 50V NP0 0402; Decal: C0402; PCB DECAL: C0402
C71 C74 C82 C91 = C0805_16V_X7R: CAP CER 10V 20% X5R 0805; Decal: C0805; PCB DECAL: C0805
C72 C73 C75 = C0603_16V_X7R: CAP CER 6.3V 20% X5R 0603; Decal: C0603; PCB DECAL: C0603
C83 C92 = C0603_16V_X7R: CAP CER 10V 20% X5R 0603; Decal: C0603; PCB DECAL: C0603
D1 = DIODE_SCHOTTKY_MBRM110ET1G: DIODE SCHOTTKY 10V 1A POWERMITE; Manufacturer: On Semiconductor; Decal: DO-216AA; Digikey: MBRM110ET1GOSCT-ND; PCB DECAL: DO-216AA
D2 = DIODE_SCHOTTKY_CFSH05-20L: DIODE SCHOTTKY, 220mV@10mA, SOD882L; Manufacturer: Central Semiconductor Corp; Part Number: CFSH05-20L TR; Decal: SOD882L; Digikey: CFSH05-20L CT-ND; PCB DECAL: SOD882L
L1 = IND_VLF3010AT-2R2M1R0: Inductor Power 2.2uH 1.0A SMD 20%; Manufacturer: TDK Corporation; Decal: IND_SMD_VLF3010A_COILS; Digikey: 445-3215-1-ND; Height: 1 (mm); Part Number: VLF3010AT-2R2M1R0; Size: 2.8 L x 2.6 W (mm); PCB DECAL: IND_SMD_VLF3010A_COILS
L2 = IND_VLF3010AT-3R3MR87: Inductor Power 3.3uH 0.87A SMD 20%; Manufacturer: TDK Corporation; Decal: IND_SMD_VLF3010A_COILS; Digikey: 445-3216-1-ND; Height: 1 (mm); Part Number: VLF3010AT-3R3MR87; Size: 2.8 L x 2.6 W (mm); PCB DECAL: IND_SMD_VLF3010A_COILS
L3 L4 = L0805_BLM21PG221SN1D: FERRITE 2A 220OHM@100MHz 0805 SMD; Decal: L0805; Digikey: 490-1054-1-ND; Part Number: BLM21PG221SN1D; PCB DECAL: L0805
L5 L6 = L0805_BKP2125HS600-T: FERRITE 3A 60OHM@100MHz 0805 SMD; Decal: L0805; Digikey: 587-1932-1-ND; Part Number: BKP2125HS600-T; PCB DECAL: L0805
LD1 = LED0805_GREEN: LED GREEN 0805 SMD, Diffused, 567nm; Decal: LED0805; PCB DECAL: LED0805
R62 = R0805_5%: RES 1/8W 5% 0805 SMD; Decal: R0805; PCB DECAL: R0805
R63 R64 R67 R69 = R0402_5%: RES 1/16W 5% 0402 SMD; Decal: R0402; PCB DECAL: R0402
R65 R66 R68 R72 = R0402_1%: RES 1/16W 1% 0402 SMD; Decal: R0402; PCB DECAL: R0402
R70 R73 = R0402_1%: RES 1/16W 0.5% 0402 SMD; Decal: R0402; PCB DECAL: R0402
R71 R74 R75 = R0603_5%: RES 1/10W 5% 0603 SMD; Decal: R0603; PCB DECAL: R0603
TP4-TP7 = VIA_20_40: Via, 20 ID, 40 OD (mil); Decal: VIA_20_40; Size: 20 ID, 40 OD (mil); PCB DECAL: VIA_20_40
U1 = MCU_F28379DZWT_337PIN: as U1 on sheet GPIO,CONNECTOR; Decal: TI_ZWT_337BGA; PCB DECAL: TI_ZWT_337BGA
U14 = IC_LDO_TPS62420DRC: IC Dual Step Down Converter, 2.25MHz, 600mA/1A; Decal: TI_DRC10; Digikey: 296-25650-1-ND; Part Number: TPS62420DRC; PCB DECAL: TI_DRC_10

## Sheet USB.SchDoc: F2837x controlCARD
size 431 x 279 mm; Organization: Texas Instruments; Revision: 1.3
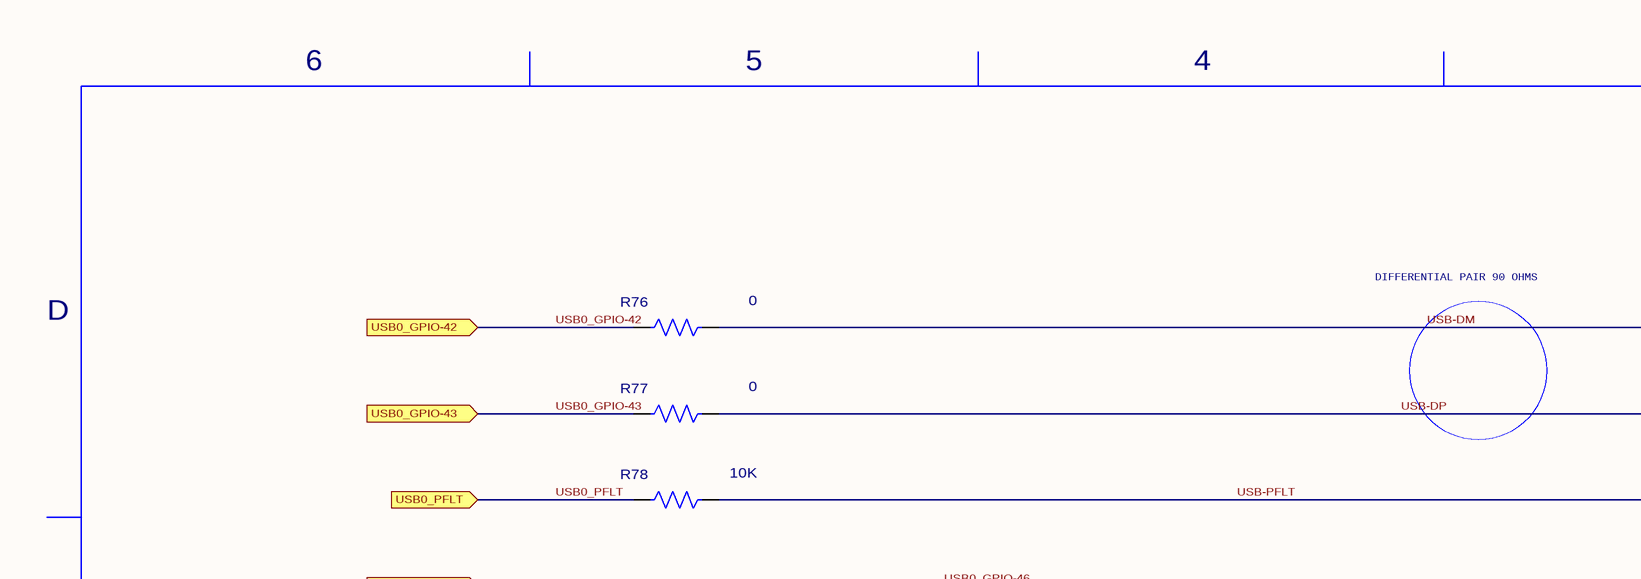
[diagram p15: USB.SchDoc, top left]
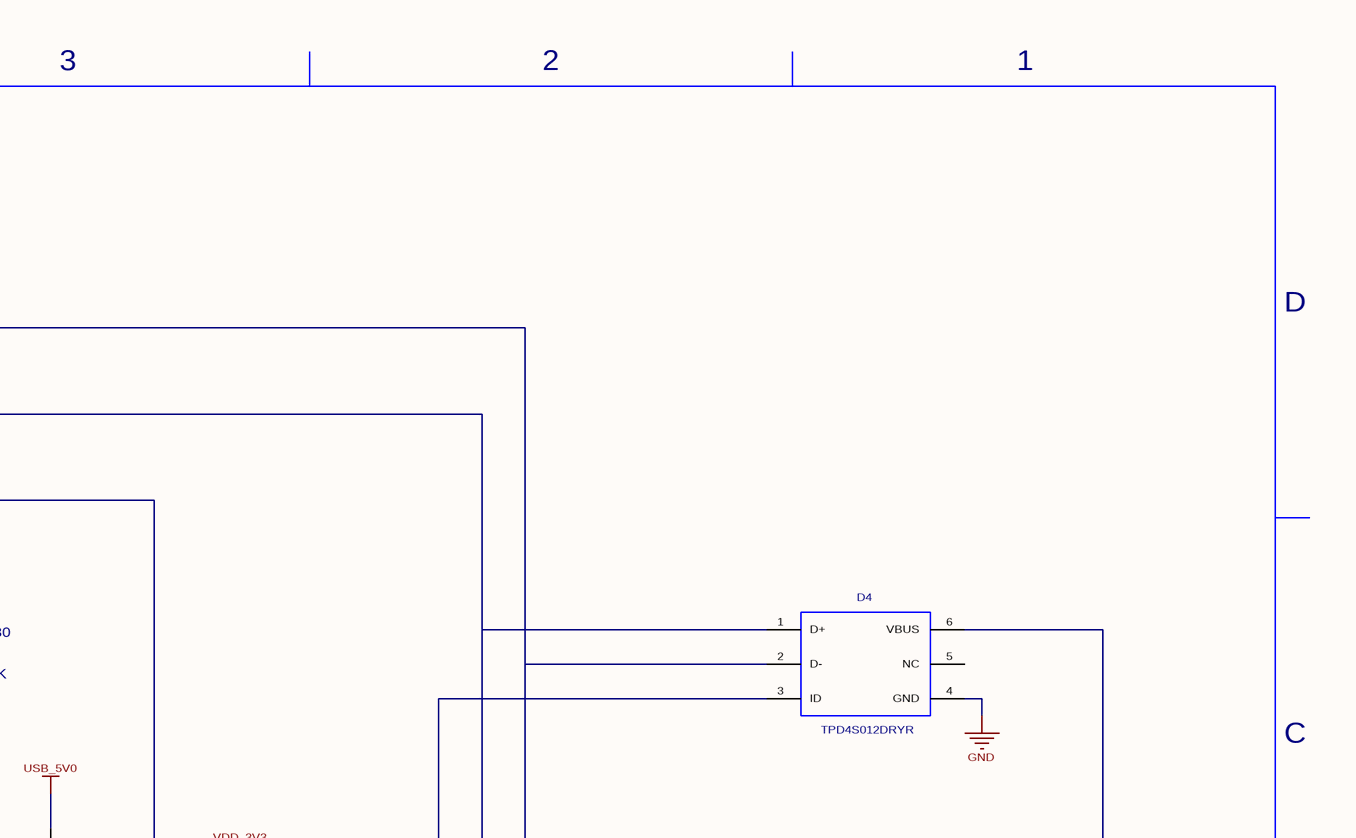
[diagram p16: USB.SchDoc, top right]
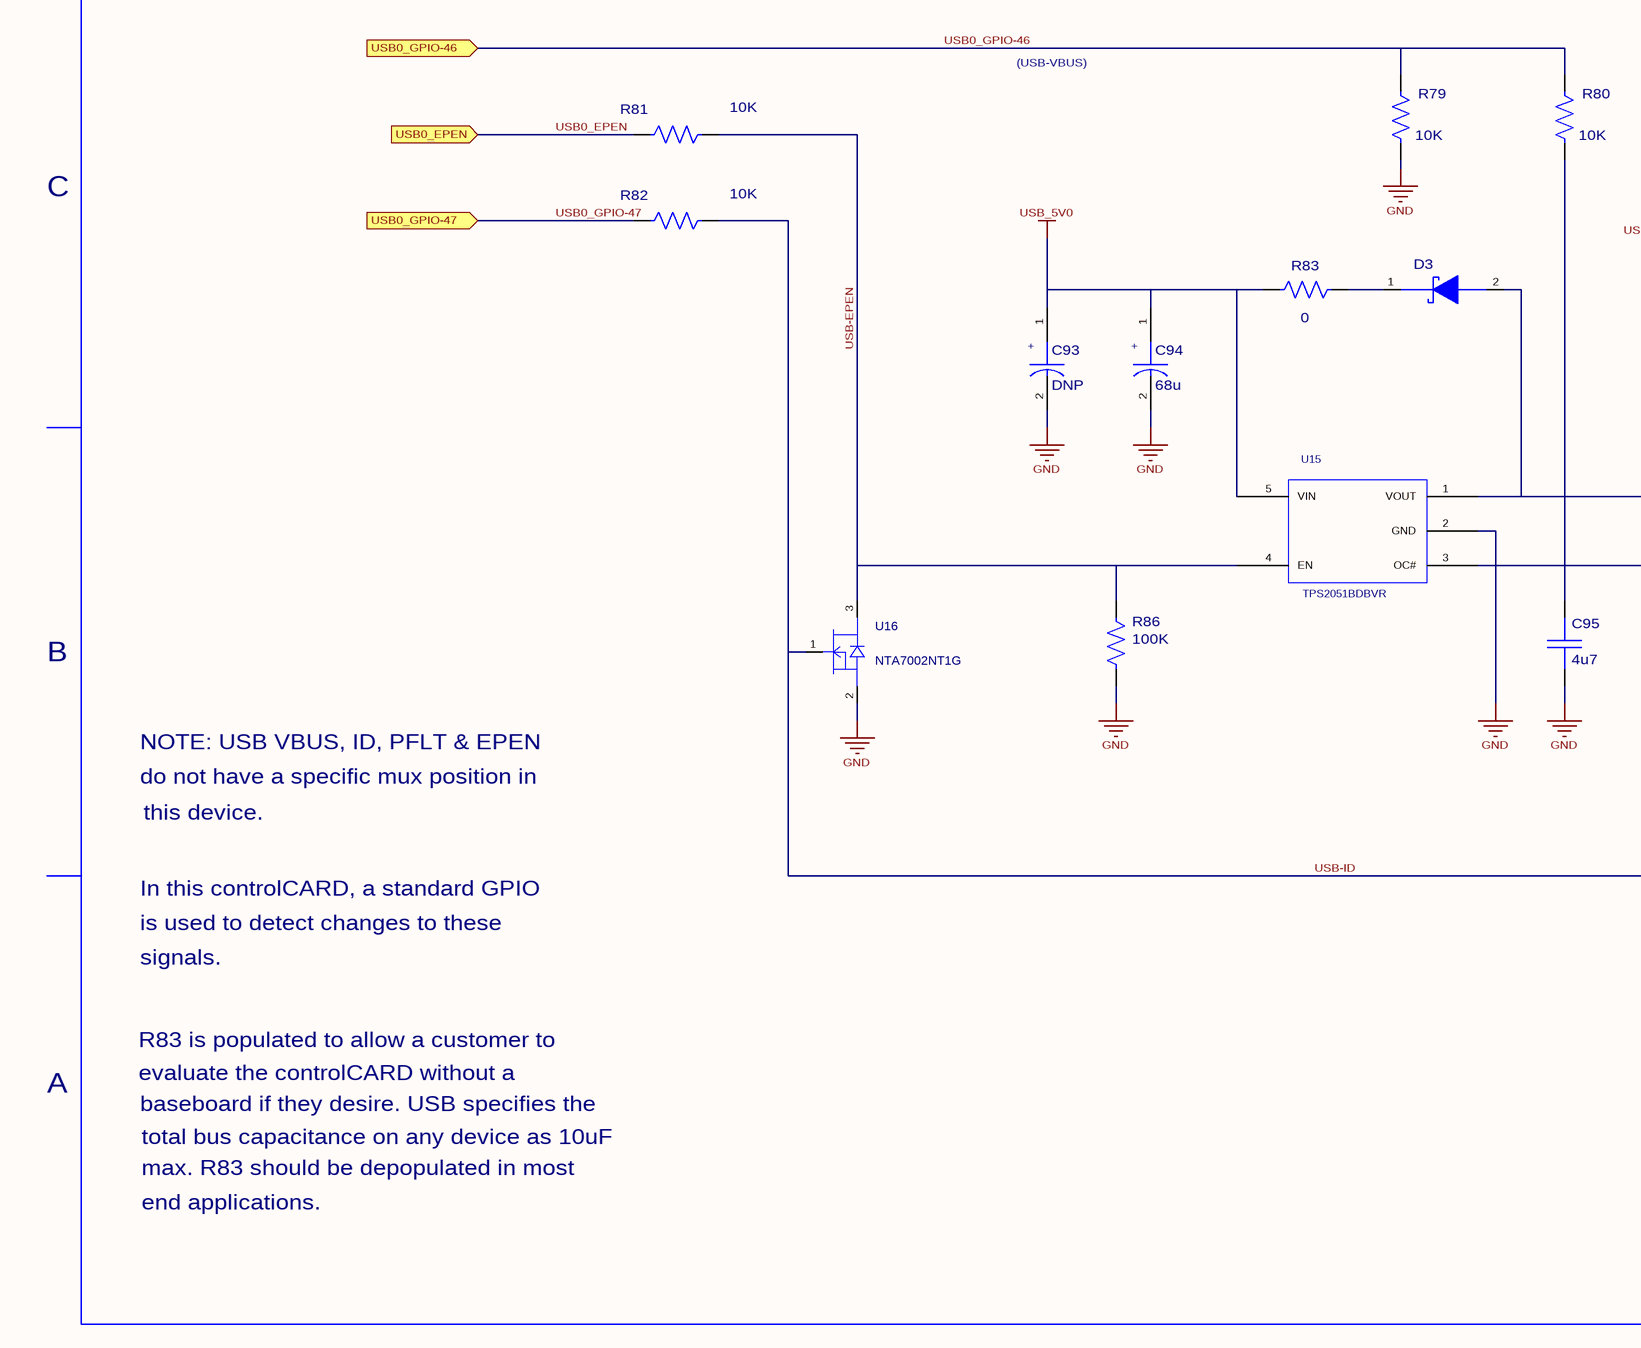
[diagram p17: USB.SchDoc, bottom left]
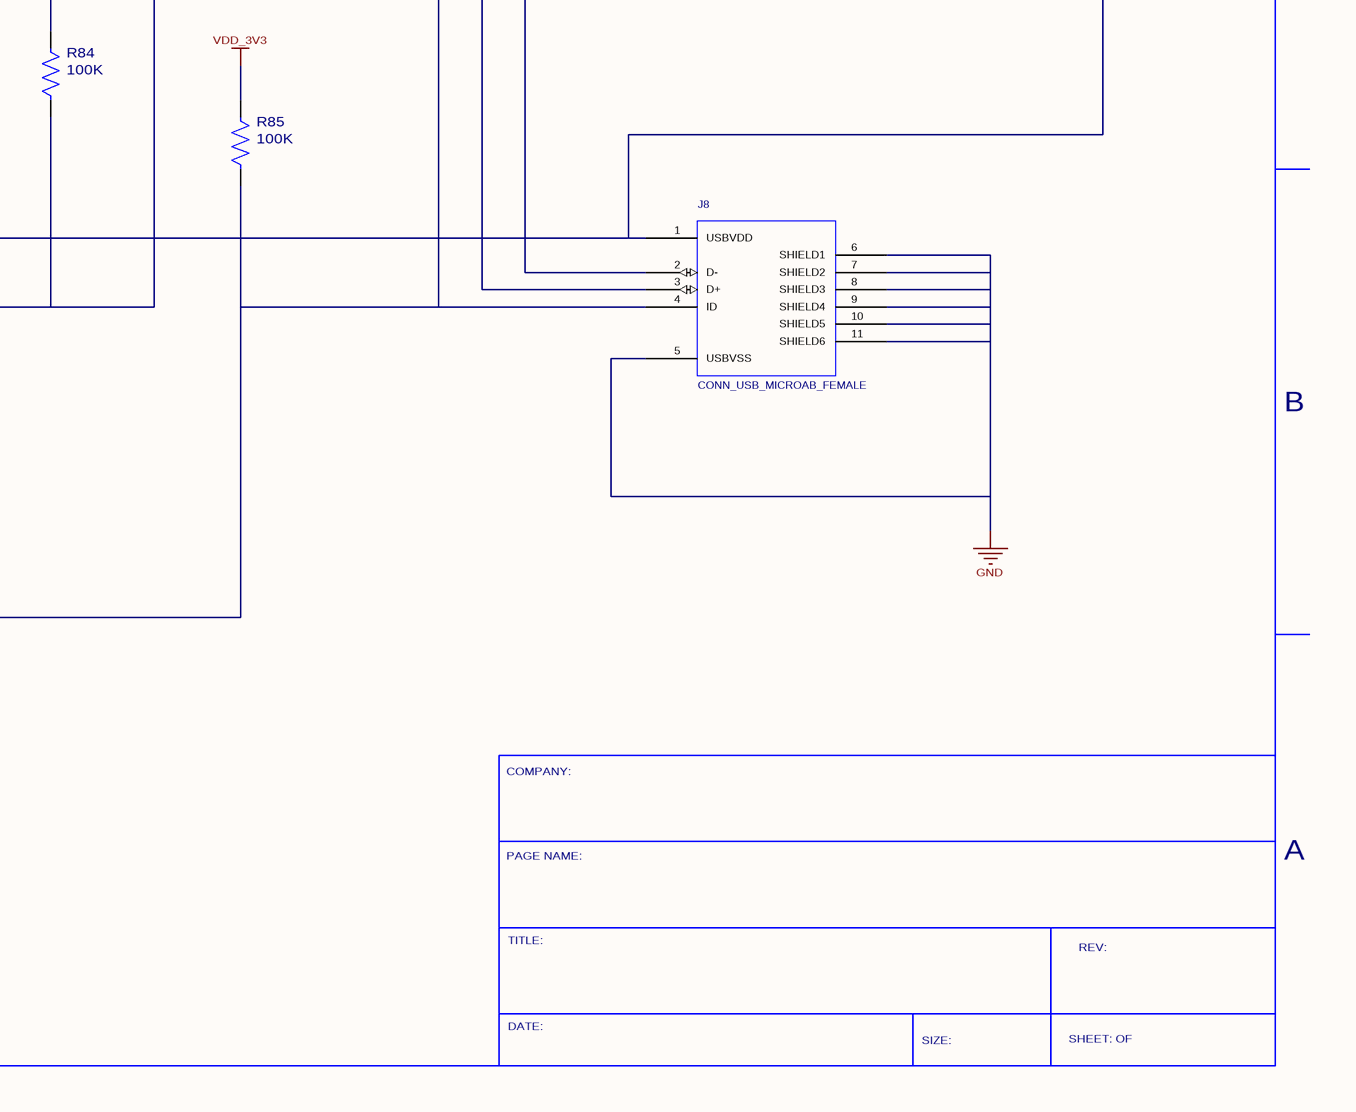
[diagram p18: USB.SchDoc, bottom right]

### Parts
C93  value DNP  [C1206P]  (hidden comment: C1206_10V_TANT)
C94  value 68u  [C1206P]  (hidden comment: C1206_10V_TANT)
C95  value 4u7  [C0603]  (hidden comment: C0603_16V_X7R)
D3  DIODE_SCHOTTKY_MBRM110ET1G  [DO-216AA]  (value not drawn)
D4  Part Number: TPD4S012DRYR  [TI_DRY_6_(R-PUSON-N6)]  (hidden comment: DIODE_USBOTG_TPD4S012DRY)
J8  CONN_USB_MICROAB_FEMALE  [CONN_USB_MICROAB_FEMALE]
R76  value 0  [R0402]  (hidden comment: R0402_5%)
R77  value 0  [R0402]  (hidden comment: R0402_5%)
R78  value 10K  [R0402]  (hidden comment: R0402_5%)
R79  value 10K  [R0402]  (hidden comment: R0402_5%)
R80  value 10K  [R0402]  (hidden comment: R0402_5%)
R81  value 10K  [R0402]  (hidden comment: R0402_5%)
R82  value 10K  [R0402]  (hidden comment: R0402_5%)
R83  value 0  [R0603]  (hidden comment: R0603_5%)
R84  value 100K  [R0603]  (hidden comment: R0603_5%)
R85  value 100K  [R0603]  (hidden comment: R0603_5%)
R86  value 100K  [R0603]  (hidden comment: R0603_5%)
U15  value TPS2051BDBVR  [SOT-23-5]  (hidden comment: IC_TPS2051BDBVR)
U16  value NTA7002NT1G  [SC-75]  (hidden comment: MOSFET_30V_0.154A_NTA7002NT1G)

### Ports
USB0_EPEN, USB0_GPIO-42, USB0_GPIO-43, USB0_GPIO-46, USB0_GPIO-47, USB0_PFLT

### Nets
GND: C93.2 C94.2 C95.1 D4.4(GND) J8.5(USBVSS) J8.6(SHIELD1) J8.7(SHIELD2) J8.8(SHIELD3) J8.9(SHIELD4) J8.10(SHIELD5) J8.11(SHIELD6) R79.2 R86.2 U15.2(GND) U16.2(D)
USB_5V0: C93.1 C94.1 R83.1 R84.1 U15.5(VIN)
VDD_3V3: R85.1
USB0_EPEN: R81.1 ; port USB0_EPEN
USB0_GPIO-42: R76.1 ; port USB0_GPIO-42
USB0_GPIO-43: R77.1 ; port USB0_GPIO-43
USB0_GPIO-46: R79.1 R80.1 ; port USB0_GPIO-46
USB0_GPIO-47: R82.1 ; port USB0_GPIO-47
USB0_PFLT: R78.1 ; port USB0_PFLT
USB-DM: D4.2(D-) J8.2(D-) R76.2
USB-DP: D4.1(D+) J8.3(D+) R77.2
USB-EPEN: R81.2 R86.1 U15.4(EN) U16.3(S)
USB-ID: D4.3(ID) J8.4(ID) R82.2 R85.2 U16.1(G)
USB-PFLT: R78.2 R84.2 U15.3(OC#)
NetC95_2: C95.2 D3.2(A) D4.6(VBUS) J8.1(USBVDD) R80.2 U15.1(VOUT)
NetD3_1: D3.1(C) R83.2

Not connected (* = marked no-connect by the designer): D4 5(NC)

### Notes on the sheet
- 6
- 5
- 4
- 3
- 2
- 1
- DIFFERENTIAL PAIR 90 OHMS
- D
- (USB-VBUS)
- C
- B
- NOTE: USB VBUS, ID, PFLT & EPEN
- do not have a specific mux position in
- In this controlCARD, a standard GPIO
- this device.
- is used to detect changes to these
- signals.
- R83 is populated to allow a customer to
- COMPANY:
- A
- evaluate the controlCARD without a
- baseboard if they desire. USB specifies the
- total bus capacitance on any device as 10uF
- PAGE NAME:
- max. R83 should be depopulated in most
- end applications.
- TITLE:
- REV:
- DATE:
- SIZE:
- SHEET: OF
- (in symbol C1206_10V_TANT) +

### Library data of the parts
C93 = C1206_10V_TANT: CAP TANT 20% 1206; Decal: C1206P; PCB DECAL: C1206P
C94 = C1206_10V_TANT: CAP TANT 10V 20% 1206; Part Number: TLJA686M010R1500; Decal: C1206P; Digikey: 478-4925-1-ND; PCB DECAL: C1206P
C95 = C0603_16V_X7R: CAP CER 6.3V 10% X5R 0603; Decal: C0603; PCB DECAL: C0603
D3 = DIODE_SCHOTTKY_MBRM110ET1G: as D1 on sheet POWER; Decal: DO-216AA; Digikey: MBRM110ET1GOSCT-ND; Part Number: MBRM110ET1G; PCB DECAL: DO-216AA
D4 = DIODE_USBOTG_TPD4S012DRY: 4-channel USB ESD Diode for USB-HS/USB OTG; 6SON; Manufacturer: Texas Instruments; Decal: TI_DRY_6; Value: TPD4S012DRYR; Digikey: 296-24244-1-ND; PCB DECAL: TI_DRY_6_(R-PUSON-N6)
J8 = CONN_USB_MICROAB_FEMALE: USB micro AB Female USB2.0; Manufacturer: TE Connectivity; Part Number: 1981584-1; Decal: CONN_USB_MICROAB_FEMALE; Digikey: A97799CT-ND; PCB DECAL: CONN_USB_MICROAB_FEMALE
R76-R82 = R0402_5%: RES 1/16W 5% 0402 SMD; Decal: R0402; PCB DECAL: R0402
R83-R86 = R0603_5%: RES 1/10W 5% 0603 SMD; Decal: R0603; PCB DECAL: R0603
U15 = IC_TPS2051BDBVR: High-Side Power Distribution Switch; Manufacturer: Texas Instruments; Decal: SOT23-5; PCB DECAL: SOT-23-5; Digikey: 296-21265-1-ND; Mouser: 595-TPS2051BDBVR; Part Number: TPS2051BDBVR
U16 = MOSFET_30V_0.154A_NTA7002NT1G: N-channel MOSFET 30V 0.154A; Manufacturer: On Semiconductor; PCB DECAL: SC-75; Decal: SC-75; Digikey: NTA7002NT1GOSCT-ND; Part Number: NTA7002NT1G